# Altium project Assem_Stn_2_Rev1.PrjPcb (part 1 of 3)
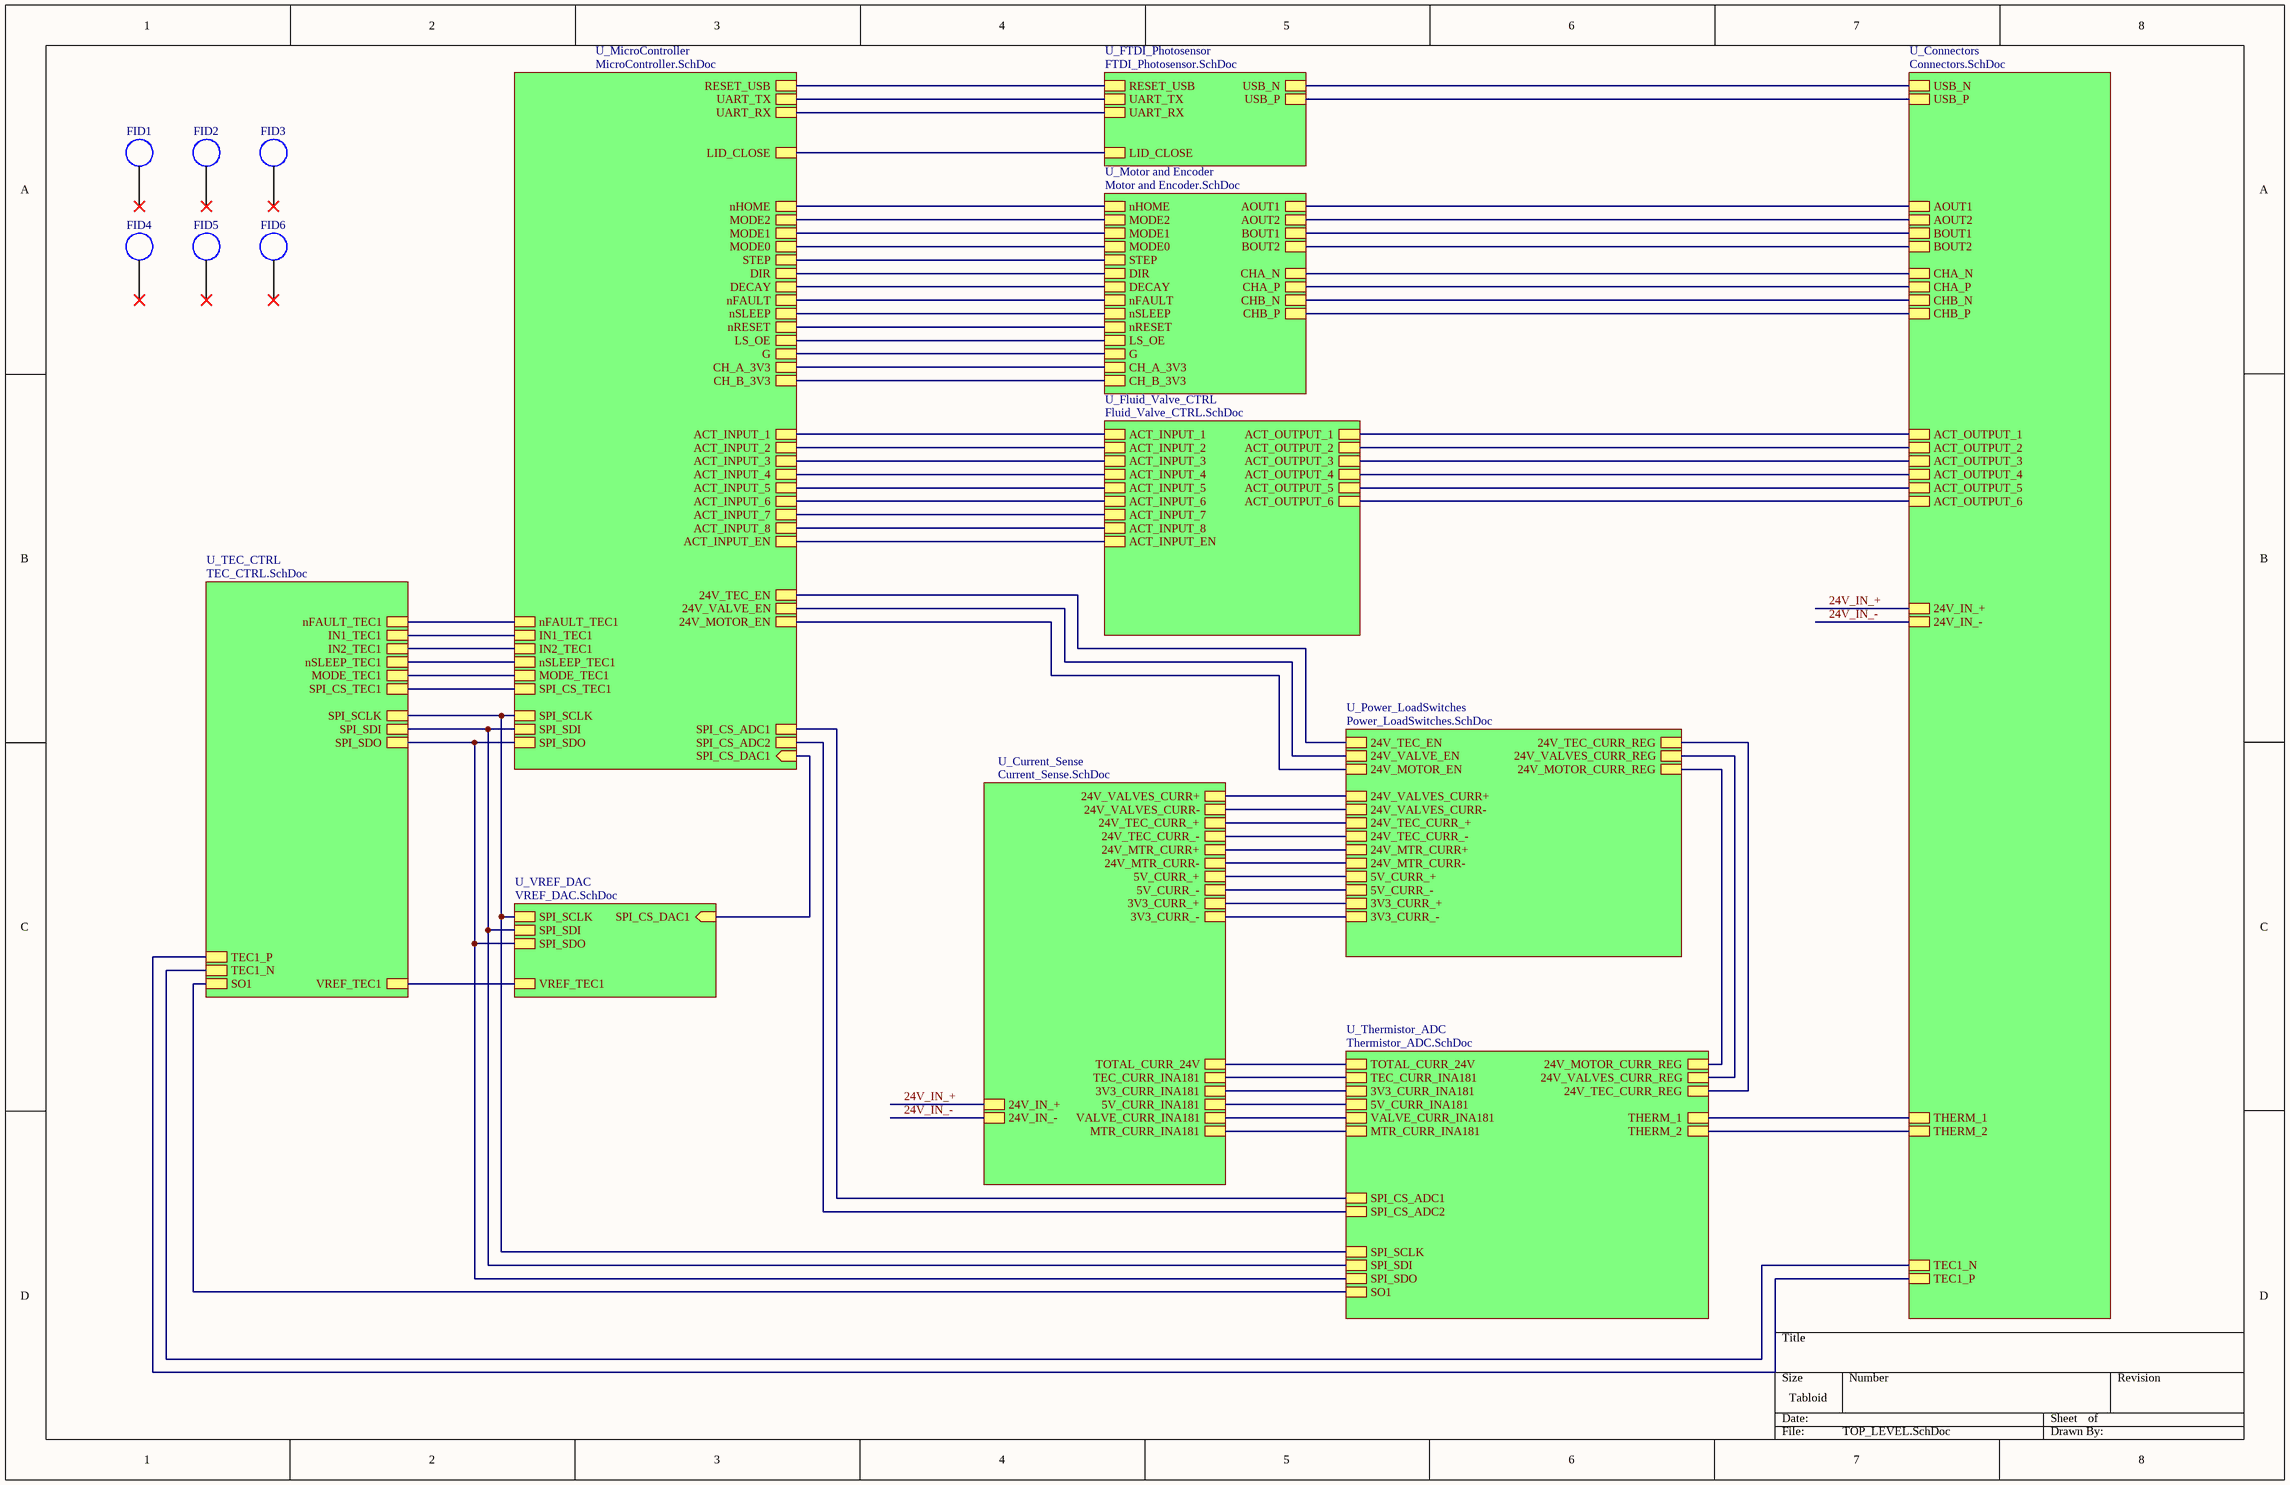
[diagram p0: TOP_LEVEL.SchDoc]
11 sheets, 438 parts. Net scope: hierarchical (ports join the sheet entries above them; power ports are global).
Board file: ASSEM_STN_2_Rev1.PcbDoc
Sheets:
  TOP_LEVEL.SchDoc
    U_Motor and Encoder = Motor and Encoder.SchDoc
    U_Power_LoadSwitches = Power_LoadSwitches.SchDoc
    U_TEC_CTRL = TEC_CTRL.SchDoc
    U_Fluid_Valve_CTRL = Fluid_Valve_CTRL.SchDoc
    U_Thermistor_ADC = Thermistor_ADC.SchDoc
    U_VREF_DAC = VREF_DAC.SchDoc
    U_Current_Sense = Current_Sense.SchDoc
    U_FTDI_Photosensor = FTDI_Photosensor.SchDoc
    U_MicroController = MicroController.SchDoc
    U_Connectors = Connectors.SchDoc

## Sheet TOP_LEVEL.SchDoc
size Tabloid; SheetNumber: 1; SheetTotal: 11

### Parts
FID1  FIDUCIAL  [Fiducial]  (value not drawn)
FID2  FIDUCIAL  [Fiducial]  (value not drawn)
FID3  FIDUCIAL  [Fiducial]  (value not drawn)
FID4  FIDUCIAL  [Fiducial]  (value not drawn)
FID5  FIDUCIAL  [Fiducial]  (value not drawn)
FID6  FIDUCIAL  [Fiducial]  (value not drawn)

### Sub-sheets
U_Connectors = Connectors.SchDoc: 24V_IN_+, 24V_IN_-, TEC1_P, TEC1_N, THERM_1, THERM_2, ACT_OUTPUT_1, ACT_OUTPUT_2, ACT_OUTPUT_3, ACT_OUTPUT_4, ACT_OUTPUT_5, ACT_OUTPUT_6, CHA_N, CHA_P, CHB_N, CHB_P, AOUT1, AOUT2, BOUT1, BOUT2, USB_N, USB_P
U_Current_Sense = Current_Sense.SchDoc: 24V_TEC_CURR_+, 24V_TEC_CURR_-, TEC_CURR_INA181, TOTAL_CURR_24V, 24V_IN_+, 24V_IN_-, 24V_VALVES_CURR+, 24V_VALVES_CURR-, VALVE_CURR_INA181, 5V_CURR_INA181, 3V3_CURR_INA181, 5V_CURR_+, 5V_CURR_-, 3V3_CURR_+, 3V3_CURR_-, 24V_MTR_CURR+, 24V_MTR_CURR-, MTR_CURR_INA181
U_Fluid_Valve_CTRL = Fluid_Valve_CTRL.SchDoc: ACT_INPUT_1, ACT_INPUT_2, ACT_INPUT_3, ACT_INPUT_4, ACT_OUTPUT_1, ACT_OUTPUT_2, ACT_OUTPUT_3, ACT_OUTPUT_4, ACT_INPUT_5, ACT_INPUT_6, ACT_INPUT_7, ACT_INPUT_8, ACT_OUTPUT_5, ACT_OUTPUT_6, ACT_INPUT_EN
U_FTDI_Photosensor = FTDI_Photosensor.SchDoc: RESET_USB, USB_N, USB_P, UART_TX, UART_RX, LID_CLOSE
U_MicroController = MicroController.SchDoc: UART_TX, UART_RX, nHOME, nFAULT, nSLEEP, nRESET, SPI_CS_DAC1 (in), SPI_CS_ADC1, SPI_CS_ADC2, CH_A_3V3, CH_B_3V3, IN1_TEC1, IN2_TEC1, nSLEEP_TEC1, MODE_TEC1, SPI_SCLK, SPI_SDI, SPI_CS_TEC1, nFAULT_TEC1, LS_OE, G, MODE2, MODE1, MODE0, STEP, DIR, DECAY, 24V_MOTOR_EN, 24V_VALVE_EN, 24V_TEC_EN, LID_CLOSE, SPI_SDO, ACT_INPUT_EN, RESET_USB, ACT_INPUT_1, ACT_INPUT_2, ACT_INPUT_3, ACT_INPUT_4, ACT_INPUT_5, ACT_INPUT_6, ACT_INPUT_7, ACT_INPUT_8
U_Motor and Encoder = Motor and Encoder.SchDoc: AOUT1, AOUT2, BOUT1, BOUT2, nHOME, MODE2, MODE1, MODE0, STEP, DIR, DECAY, nFAULT, nSLEEP, nRESET, CHA_N, CHA_P, CHB_N, CHB_P, G, CH_A_3V3, CH_B_3V3, LS_OE
U_Power_LoadSwitches = Power_LoadSwitches.SchDoc: 24V_TEC_EN, 24V_TEC_CURR_REG, 24V_VALVE_EN, 24V_VALVES_CURR_REG, 24V_VALVES_CURR+, 24V_VALVES_CURR-, 24V_TEC_CURR_+, 24V_TEC_CURR_-, 24V_MOTOR_EN, 24V_MOTOR_CURR_REG, 24V_MTR_CURR+, 24V_MTR_CURR-, 5V_CURR_+, 5V_CURR_-, 3V3_CURR_+, 3V3_CURR_-
U_TEC_CTRL = TEC_CTRL.SchDoc: IN1_TEC1, IN2_TEC1, nSLEEP_TEC1, MODE_TEC1, SPI_SCLK, SPI_SDI, SPI_CS_TEC1, SPI_SDO, nFAULT_TEC1, TEC1_P, TEC1_N, SO1, VREF_TEC1
U_Thermistor_ADC = Thermistor_ADC.SchDoc: THERM_1, THERM_2, SPI_CS_ADC1, 24V_TEC_CURR_REG, 24V_VALVES_CURR_REG, TEC_CURR_INA181, TOTAL_CURR_24V, VALVE_CURR_INA181, SPI_CS_ADC2, SPI_SDO, SPI_SDI, SPI_SCLK, 5V_CURR_INA181, 3V3_CURR_INA181, 24V_MOTOR_CURR_REG, SO1, MTR_CURR_INA181
U_VREF_DAC = VREF_DAC.SchDoc: VREF_TEC1, SPI_CS_DAC1 (in), SPI_SCLK, SPI_SDI, SPI_SDO

### Nets
3V3_CURR_+: sheet U_Power_LoadSwitches/3V3_CURR_+, sheet U_Current_Sense/3V3_CURR_+
3V3_CURR_-: sheet U_Power_LoadSwitches/3V3_CURR_-, sheet U_Current_Sense/3V3_CURR_-
3V3_CURR_INA181: sheet U_Thermistor_ADC/3V3_CURR_INA181, sheet U_Current_Sense/3V3_CURR_INA181
5V_CURR_+: sheet U_Power_LoadSwitches/5V_CURR_+, sheet U_Current_Sense/5V_CURR_+
5V_CURR_-: sheet U_Power_LoadSwitches/5V_CURR_-, sheet U_Current_Sense/5V_CURR_-
5V_CURR_INA181: sheet U_Thermistor_ADC/5V_CURR_INA181, sheet U_Current_Sense/5V_CURR_INA181
24V_IN_+: sheet U_Current_Sense/24V_IN_+, sheet U_Connectors/24V_IN_+
24V_IN_-: sheet U_Current_Sense/24V_IN_-, sheet U_Connectors/24V_IN_-
24V_MOTOR_CURR_REG: sheet U_Power_LoadSwitches/24V_MOTOR_CURR_REG, sheet U_Thermistor_ADC/24V_MOTOR_CURR_REG
24V_MOTOR_EN: sheet U_Power_LoadSwitches/24V_MOTOR_EN, sheet U_MicroController/24V_MOTOR_EN
24V_MTR_CURR+: sheet U_Power_LoadSwitches/24V_MTR_CURR+, sheet U_Current_Sense/24V_MTR_CURR+
24V_MTR_CURR-: sheet U_Power_LoadSwitches/24V_MTR_CURR-, sheet U_Current_Sense/24V_MTR_CURR-
24V_TEC_CURR_+: sheet U_Power_LoadSwitches/24V_TEC_CURR_+, sheet U_Current_Sense/24V_TEC_CURR_+
24V_TEC_CURR_-: sheet U_Power_LoadSwitches/24V_TEC_CURR_-, sheet U_Current_Sense/24V_TEC_CURR_-
24V_TEC_CURR_REG: sheet U_Power_LoadSwitches/24V_TEC_CURR_REG, sheet U_Thermistor_ADC/24V_TEC_CURR_REG
24V_TEC_EN: sheet U_Power_LoadSwitches/24V_TEC_EN, sheet U_MicroController/24V_TEC_EN
24V_VALVE_EN: sheet U_Power_LoadSwitches/24V_VALVE_EN, sheet U_MicroController/24V_VALVE_EN
24V_VALVES_CURR+: sheet U_Power_LoadSwitches/24V_VALVES_CURR+, sheet U_Current_Sense/24V_VALVES_CURR+
24V_VALVES_CURR-: sheet U_Power_LoadSwitches/24V_VALVES_CURR-, sheet U_Current_Sense/24V_VALVES_CURR-
24V_VALVES_CURR_REG: sheet U_Power_LoadSwitches/24V_VALVES_CURR_REG, sheet U_Thermistor_ADC/24V_VALVES_CURR_REG
ACT_INPUT_1: sheet U_Fluid_Valve_CTRL/ACT_INPUT_1, sheet U_MicroController/ACT_INPUT_1
ACT_INPUT_2: sheet U_Fluid_Valve_CTRL/ACT_INPUT_2, sheet U_MicroController/ACT_INPUT_2
ACT_INPUT_3: sheet U_Fluid_Valve_CTRL/ACT_INPUT_3, sheet U_MicroController/ACT_INPUT_3
ACT_INPUT_4: sheet U_Fluid_Valve_CTRL/ACT_INPUT_4, sheet U_MicroController/ACT_INPUT_4
ACT_INPUT_5: sheet U_Fluid_Valve_CTRL/ACT_INPUT_5, sheet U_MicroController/ACT_INPUT_5
ACT_INPUT_6: sheet U_Fluid_Valve_CTRL/ACT_INPUT_6, sheet U_MicroController/ACT_INPUT_6
ACT_INPUT_7: sheet U_Fluid_Valve_CTRL/ACT_INPUT_7, sheet U_MicroController/ACT_INPUT_7
ACT_INPUT_8: sheet U_Fluid_Valve_CTRL/ACT_INPUT_8, sheet U_MicroController/ACT_INPUT_8
ACT_INPUT_EN: sheet U_Fluid_Valve_CTRL/ACT_INPUT_EN, sheet U_MicroController/ACT_INPUT_EN
ACT_OUTPUT_1: sheet U_Fluid_Valve_CTRL/ACT_OUTPUT_1, sheet U_Connectors/ACT_OUTPUT_1
ACT_OUTPUT_2: sheet U_Fluid_Valve_CTRL/ACT_OUTPUT_2, sheet U_Connectors/ACT_OUTPUT_2
ACT_OUTPUT_3: sheet U_Fluid_Valve_CTRL/ACT_OUTPUT_3, sheet U_Connectors/ACT_OUTPUT_3
ACT_OUTPUT_4: sheet U_Fluid_Valve_CTRL/ACT_OUTPUT_4, sheet U_Connectors/ACT_OUTPUT_4
ACT_OUTPUT_5: sheet U_Fluid_Valve_CTRL/ACT_OUTPUT_5, sheet U_Connectors/ACT_OUTPUT_5
ACT_OUTPUT_6: sheet U_Fluid_Valve_CTRL/ACT_OUTPUT_6, sheet U_Connectors/ACT_OUTPUT_6
AOUT1: sheet U_Motor and Encoder/AOUT1, sheet U_Connectors/AOUT1
AOUT2: sheet U_Motor and Encoder/AOUT2, sheet U_Connectors/AOUT2
BOUT1: sheet U_Motor and Encoder/BOUT1, sheet U_Connectors/BOUT1
BOUT2: sheet U_Motor and Encoder/BOUT2, sheet U_Connectors/BOUT2
CH_A_3V3: sheet U_Motor and Encoder/CH_A_3V3, sheet U_MicroController/CH_A_3V3
CH_B_3V3: sheet U_Motor and Encoder/CH_B_3V3, sheet U_MicroController/CH_B_3V3
CHA_N: sheet U_Motor and Encoder/CHA_N, sheet U_Connectors/CHA_N
CHA_P: sheet U_Motor and Encoder/CHA_P, sheet U_Connectors/CHA_P
CHB_N: sheet U_Motor and Encoder/CHB_N, sheet U_Connectors/CHB_N
CHB_P: sheet U_Motor and Encoder/CHB_P, sheet U_Connectors/CHB_P
DECAY: sheet U_Motor and Encoder/DECAY, sheet U_MicroController/DECAY
DIR: sheet U_Motor and Encoder/DIR, sheet U_MicroController/DIR
G: sheet U_Motor and Encoder/G, sheet U_MicroController/G
IN1_TEC1: sheet U_TEC_CTRL/IN1_TEC1, sheet U_MicroController/IN1_TEC1
IN2_TEC1: sheet U_TEC_CTRL/IN2_TEC1, sheet U_MicroController/IN2_TEC1
LID_CLOSE: sheet U_FTDI_Photosensor/LID_CLOSE, sheet U_MicroController/LID_CLOSE
LS_OE: sheet U_Motor and Encoder/LS_OE, sheet U_MicroController/LS_OE
MODE0: sheet U_Motor and Encoder/MODE0, sheet U_MicroController/MODE0
MODE1: sheet U_Motor and Encoder/MODE1, sheet U_MicroController/MODE1
MODE2: sheet U_Motor and Encoder/MODE2, sheet U_MicroController/MODE2
MODE_TEC1: sheet U_TEC_CTRL/MODE_TEC1, sheet U_MicroController/MODE_TEC1
MTR_CURR_INA181: sheet U_Thermistor_ADC/MTR_CURR_INA181, sheet U_Current_Sense/MTR_CURR_INA181
nFAULT: sheet U_Motor and Encoder/nFAULT, sheet U_MicroController/nFAULT
nFAULT_TEC1: sheet U_TEC_CTRL/nFAULT_TEC1, sheet U_MicroController/nFAULT_TEC1
nHOME: sheet U_Motor and Encoder/nHOME, sheet U_MicroController/nHOME
nRESET: sheet U_Motor and Encoder/nRESET, sheet U_MicroController/nRESET
nSLEEP: sheet U_Motor and Encoder/nSLEEP, sheet U_MicroController/nSLEEP
nSLEEP_TEC1: sheet U_TEC_CTRL/nSLEEP_TEC1, sheet U_MicroController/nSLEEP_TEC1
RESET_USB: sheet U_FTDI_Photosensor/RESET_USB, sheet U_MicroController/RESET_USB
SO1: sheet U_TEC_CTRL/SO1, sheet U_Thermistor_ADC/SO1
SPI_CS_ADC1: sheet U_Thermistor_ADC/SPI_CS_ADC1, sheet U_MicroController/SPI_CS_ADC1
SPI_CS_ADC2: sheet U_Thermistor_ADC/SPI_CS_ADC2, sheet U_MicroController/SPI_CS_ADC2
SPI_CS_DAC1: sheet U_VREF_DAC/SPI_CS_DAC1, sheet U_MicroController/SPI_CS_DAC1
SPI_CS_TEC1: sheet U_TEC_CTRL/SPI_CS_TEC1, sheet U_MicroController/SPI_CS_TEC1
SPI_SCLK: sheet U_TEC_CTRL/SPI_SCLK, sheet U_Thermistor_ADC/SPI_SCLK, sheet U_VREF_DAC/SPI_SCLK, sheet U_MicroController/SPI_SCLK
SPI_SDI: sheet U_TEC_CTRL/SPI_SDI, sheet U_Thermistor_ADC/SPI_SDI, sheet U_VREF_DAC/SPI_SDI, sheet U_MicroController/SPI_SDI
SPI_SDO: sheet U_TEC_CTRL/SPI_SDO, sheet U_Thermistor_ADC/SPI_SDO, sheet U_VREF_DAC/SPI_SDO, sheet U_MicroController/SPI_SDO
STEP: sheet U_Motor and Encoder/STEP, sheet U_MicroController/STEP
TEC1_N: sheet U_TEC_CTRL/TEC1_N, sheet U_Connectors/TEC1_N
TEC1_P: sheet U_TEC_CTRL/TEC1_P, sheet U_Connectors/TEC1_P
TEC_CURR_INA181: sheet U_Thermistor_ADC/TEC_CURR_INA181, sheet U_Current_Sense/TEC_CURR_INA181
THERM_1: sheet U_Thermistor_ADC/THERM_1, sheet U_Connectors/THERM_1
THERM_2: sheet U_Thermistor_ADC/THERM_2, sheet U_Connectors/THERM_2
TOTAL_CURR_24V: sheet U_Thermistor_ADC/TOTAL_CURR_24V, sheet U_Current_Sense/TOTAL_CURR_24V
UART_RX: sheet U_FTDI_Photosensor/UART_RX, sheet U_MicroController/UART_RX
UART_TX: sheet U_FTDI_Photosensor/UART_TX, sheet U_MicroController/UART_TX
USB_N: sheet U_FTDI_Photosensor/USB_N, sheet U_Connectors/USB_N
USB_P: sheet U_FTDI_Photosensor/USB_P, sheet U_Connectors/USB_P
VALVE_CURR_INA181: sheet U_Thermistor_ADC/VALVE_CURR_INA181, sheet U_Current_Sense/VALVE_CURR_INA181
VREF_TEC1: sheet U_TEC_CTRL/VREF_TEC1, sheet U_VREF_DAC/VREF_TEC1

Not connected (* = marked no-connect by the designer): FID1 FID(0)*; FID2 FID(0)*; FID3 FID(0)*; FID4 FID(0)*; FID5 FID(0)*; FID6 FID(0)*

### Library data of the parts
FID1-FID6 = FIDUCIAL: 40mil Fudicial

## Sheet Motor and Encoder.SchDoc
size Tabloid; SheetNumber: 3; SheetTotal: 11
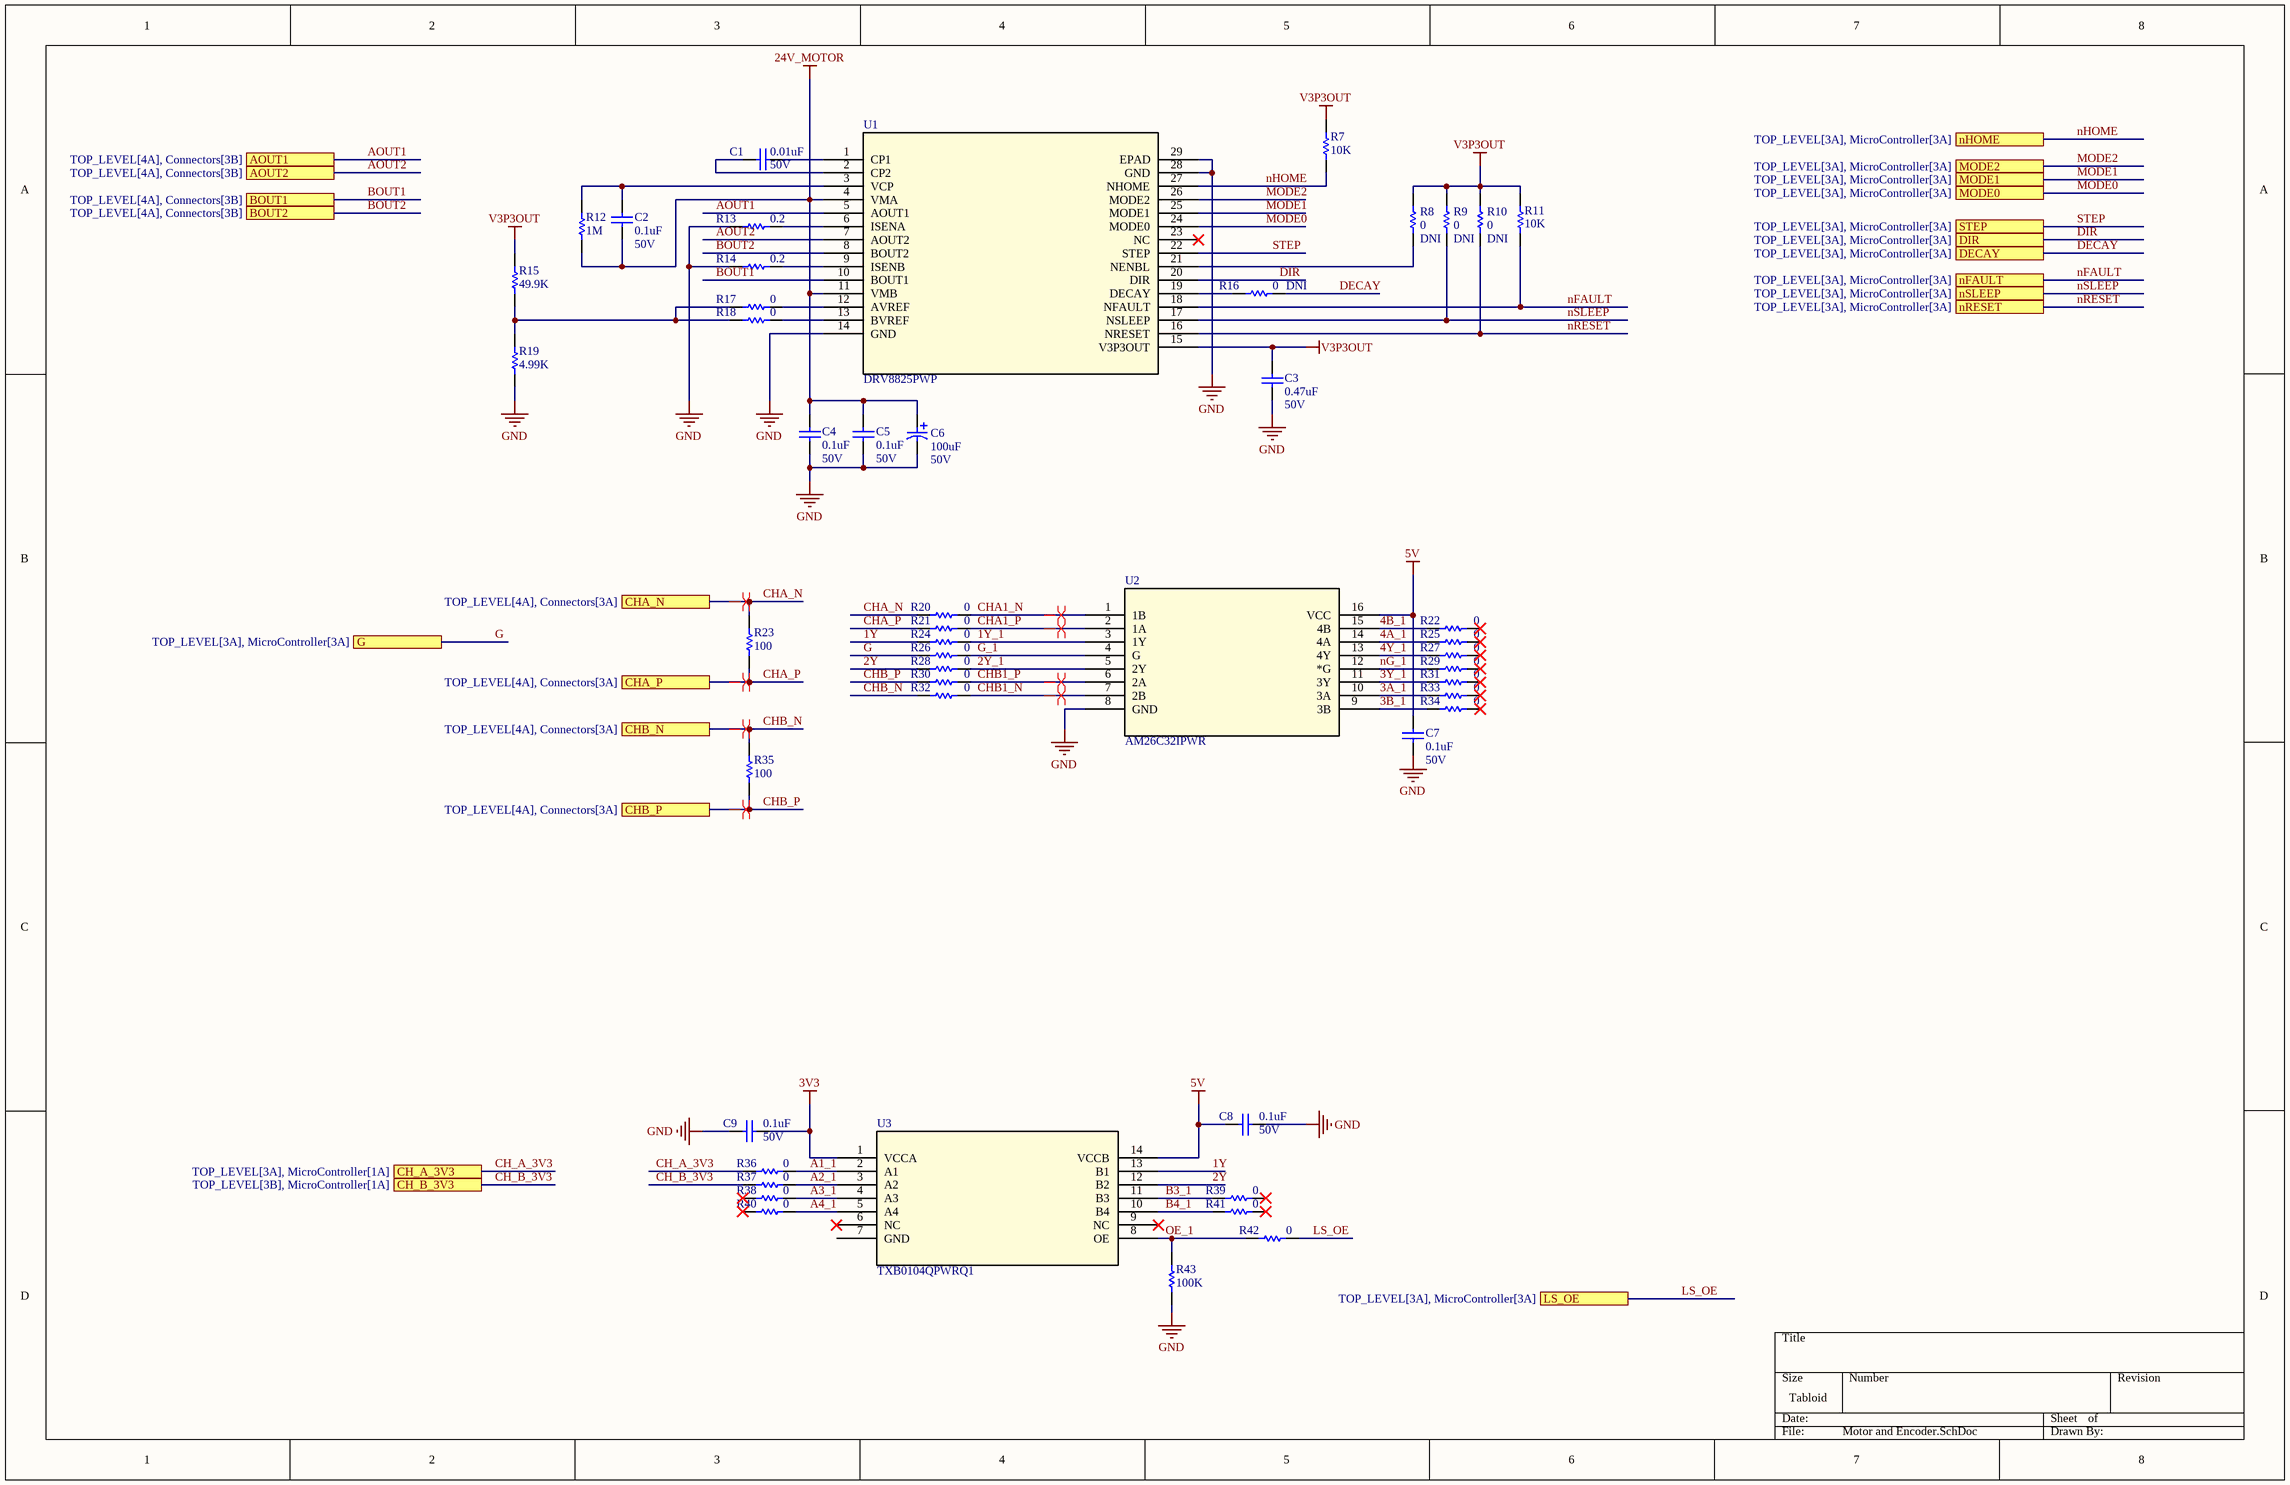
[diagram p1: Motor and Encoder.SchDoc]

### Parts
C1  value 0.01uF  Rating: 50V  [DEFAULT_CAPACITOR_0805]  (hidden comment: KGM21NR71H103KT)
C2  value 0.1uF  Rating: 50V  [DEFAULT_CAPACITOR_0805]  (hidden comment: KGM21NR71H104KT)
C3  value 0.47uF  Rating: 50V  [DEFAULT_CAPACITOR_0805]  (hidden comment: GRM21BR71H474KA88L)
C4  value 0.1uF  Rating: 50V  [DEFAULT_CAPACITOR_0805]  (hidden comment: KGM21NR71H104KT)
C5  value 0.1uF  Rating: 50V  [DEFAULT_CAPACITOR_0805]  (hidden comment: KGM21NR71H104KT)
C6  value 100uF  Rating: 50V  [UWT1H101MNL1GS]  (hidden comment: UWT1H101MNL1GS)
C7  value 0.1uF  Rating: 50V  [DEFAULT_CAPACITOR_0805]  (hidden comment: KGM21NR71H104KT)
C8  value 0.1uF  Rating: 50V  [DEFAULT_CAPACITOR_0805]  (hidden comment: KGM21NR71H104KT)
C9  value 0.1uF  Rating: 50V  [DEFAULT_CAPACITOR_0805]  (hidden comment: KGM21NR71H104KT)
R7  value 10K  [DEFAULT_RESISTOR_0805]  (hidden comment: CRCW080510K0FKEA)
R8  DNI  value 0  [DEFAULT_RESISTOR_0805]
R9  DNI  value 0  [DEFAULT_RESISTOR_0805]
R10  DNI  value 0  [DEFAULT_RESISTOR_0805]
R11  value 10K  [DEFAULT_RESISTOR_0805]  (hidden comment: CRCW080510K0FKEA)
R12  value 1M  [DEFAULT_RESISTOR_0805]  (hidden comment: CRCW08051M00FKEA)
R13  value 0.2  [DEFAULT_RESISTOR_0805]  (hidden comment: ERJ-6DSFR20V)
R14  value 0.2  [DEFAULT_RESISTOR_0805]  (hidden comment: ERJ-6DSFR20V)
R15  value 49.9K  [DEFAULT_RESISTOR_0805]  (hidden comment: RMCF0805FT49K9)
R16  DNI  value 0  [DEFAULT_RESISTOR_0805]
R17  value 0  [DEFAULT_RESISTOR_0805]  (hidden comment: RC0805JR-070RL)
R18  value 0  [DEFAULT_RESISTOR_0805]  (hidden comment: RC0805JR-070RL)
R19  value 4.99K  [DEFAULT_RESISTOR_0805]  (hidden comment: RMCF0805FT4K99)
R20  value 0  [DEFAULT_RESISTOR_0805]  (hidden comment: RC0805JR-070RL)
R21  value 0  [DEFAULT_RESISTOR_0805]  (hidden comment: RC0805JR-070RL)
R22  value 0  [DEFAULT_RESISTOR_0805]  (hidden comment: RC0805JR-070RL)
R23  value 100  [DEFAULT_RESISTOR_0805]  (hidden comment: CRCW0805100RFKEA)
R24  value 0  [DEFAULT_RESISTOR_0805]  (hidden comment: RC0805JR-070RL)
R25  value 0  [DEFAULT_RESISTOR_0805]  (hidden comment: RC0805JR-070RL)
R26  value 0  [DEFAULT_RESISTOR_0805]  (hidden comment: RC0805JR-070RL)
R27  value 0  [DEFAULT_RESISTOR_0805]  (hidden comment: RC0805JR-070RL)
R28  value 0  [DEFAULT_RESISTOR_0805]  (hidden comment: RC0805JR-070RL)
R29  value 0  [DEFAULT_RESISTOR_0805]  (hidden comment: RC0805JR-070RL)
R30  value 0  [DEFAULT_RESISTOR_0805]  (hidden comment: RC0805JR-070RL)
R31  value 0  [DEFAULT_RESISTOR_0805]  (hidden comment: RC0805JR-070RL)
R32  value 0  [DEFAULT_RESISTOR_0805]  (hidden comment: RC0805JR-070RL)
R33  value 0  [DEFAULT_RESISTOR_0805]  (hidden comment: RC0805JR-070RL)
R34  value 0  [DEFAULT_RESISTOR_0805]  (hidden comment: RC0805JR-070RL)
R35  value 100  [DEFAULT_RESISTOR_0805]  (hidden comment: CRCW0805100RFKEA)
R36  value 0  [DEFAULT_RESISTOR_0805]  (hidden comment: RC0805JR-070RL)
R37  value 0  [DEFAULT_RESISTOR_0805]  (hidden comment: RC0805JR-070RL)
R38  value 0  [DEFAULT_RESISTOR_0805]  (hidden comment: RC0805JR-070RL)
R39  value 0  [DEFAULT_RESISTOR_0805]  (hidden comment: RC0805JR-070RL)
R40  value 0  [DEFAULT_RESISTOR_0805]  (hidden comment: RC0805JR-070RL)
R41  value 0  [DEFAULT_RESISTOR_0805]  (hidden comment: RC0805JR-070RL)
R42  value 0  [DEFAULT_RESISTOR_0805]  (hidden comment: RC0805JR-070RL)
R43  value 100K  [DEFAULT_RESISTOR_0805]  (hidden comment: RC0805FR-07100KL)
U1  DRV8825PWP  [DRV8825PWP - 28HTSSTOP]
U2  AM26C32IPWR  [AM26C32IPWR]
U3  TXB0104QPWRQ1  [TXB0104QPWRQ1 - 14TSSOP]

### Ports
AOUT1 (see TOP_LEVEL[4A], Connectors[3B]), AOUT2 (see TOP_LEVEL[4A], Connectors[3B]), BOUT1 (see TOP_LEVEL[4A], Connectors[3B]), BOUT2 (see TOP_LEVEL[4A], Connectors[3B]), CH_A_3V3 (see TOP_LEVEL[3A], MicroController[1A]), CH_B_3V3 (see TOP_LEVEL[3B], MicroController[1A]), CHA_N (see TOP_LEVEL[4A], Connectors[3A]), CHA_P (see TOP_LEVEL[4A], Connectors[3A]), CHB_N (see TOP_LEVEL[4A], Connectors[3A]), CHB_P (see TOP_LEVEL[4A], Connectors[3A]), DECAY (see TOP_LEVEL[3A], MicroController[3A]), DIR (see TOP_LEVEL[3A], MicroController[3A]), G (see TOP_LEVEL[3A], MicroController[3A]), LS_OE (see TOP_LEVEL[3A], MicroController[3A]), MODE0 (see TOP_LEVEL[3A], MicroController[3A]), MODE1 (see TOP_LEVEL[3A], MicroController[3A]), MODE2 (see TOP_LEVEL[3A], MicroController[3A]), nFAULT (see TOP_LEVEL[3A], MicroController[3A]), nHOME (see TOP_LEVEL[3A], MicroController[3A]), nRESET (see TOP_LEVEL[3A], MicroController[3A]), nSLEEP (see TOP_LEVEL[3A], MicroController[3A]), STEP (see TOP_LEVEL[3A], MicroController[3A])

### Nets
3V3: C9.1 U3.1(VCCA)
5V: C7.2 C8.2 U2.16(VCC) U3.14(VCCB)
24V_MOTOR: C2.2 C4.1 C5.1 C6.1 R12.2 U1.4(VMA) U1.11(VMB)
GND: C3.1 C4.2 C5.2 C6.2 C7.1 C8.1 C9.2 R13.2 R14.2 R19.2 R43.2 U1.14(GND) U1.28(GND) U1.29(EPAD) U2.8(GND)
V3P3OUT: C3.2 R7.1 R8.1 R9.1 R10.1 R11.1 R15.1 U1.15(V3P3OUT)
1Y: R24.2 U3.13(B1)
1Y_1: R24.1 U2.3(1Y)
2Y: R28.2 U3.12(B2)
2Y_1: R28.1 U2.5(2Y)
3A_1: R33.2 U2.10(3A)
3B_1: R34.2 U2.9(3B)
3Y_1: R31.2 U2.11(3Y)
4A_1: R25.2 U2.14(4A)
4B_1: R22.2 U2.15(4B)
4Y_1: R27.2 U2.13(4Y)
A1_1: R36.1 U3.2(A1)
A2_1: R37.1 U3.3(A2)
A3_1: R38.1 U3.4(A3)
A4_1: R40.1 U3.5(A4)
AOUT1: U1.5(AOUT1) ; port AOUT1
AOUT2: U1.7(AOUT2) ; port AOUT2
B3_1: R39.2 U3.11(B3)
B4_1: R41.2 U3.10(B4)
BOUT1: U1.10(BOUT1) ; port BOUT1
BOUT2: U1.8(BOUT2) ; port BOUT2
CH_A_3V3: R36.2 ; port CH_A_3V3
CH_B_3V3: R37.2 ; port CH_B_3V3
CHA1_N: R20.1 U2.1(1B)
CHA1_P: R21.1 U2.2(1A)
CHA_N: R20.2 R23.1 ; port CHA_N
CHA_P: R21.2 R23.2 ; port CHA_P
CHB1_N: R32.1 U2.7(2B)
CHB1_P: R30.1 U2.6(2A)
CHB_N: R32.2 R35.1 ; port CHB_N
CHB_P: R30.2 R35.2 ; port CHB_P
DECAY: R16.1 ; port DECAY
DIR: U1.20(DIR) ; port DIR
G: R26.2 ; port G
G_1: R26.1 U2.4(G)
LS_OE: R42.1 ; port LS_OE
MODE0: U1.24(MODE0) ; port MODE0
MODE1: U1.25(MODE1) ; port MODE1
MODE2: U1.26(MODE2) ; port MODE2
nFAULT: R11.2 U1.18(NFAULT) ; port nFAULT
nG_1: R29.2 U2.12(*G)
nHOME: R7.2 U1.27(NHOME) ; port nHOME
nRESET: R10.2 U1.16(NRESET) ; port nRESET
nSLEEP: R9.2 U1.17(NSLEEP) ; port nSLEEP
OE_1: R42.2 R43.1 U3.8(OE)
STEP: U1.22(STEP) ; port STEP
NetC1_1: C1.1 U1.1(CP1)
NetC1_2: C1.2 U1.2(CP2)
NetC2_1: C2.1 R12.1 U1.3(VCP)
NetR8_2: R8.2 U1.21(NENBL)
NetR13_1: R13.1 U1.6(ISENA)
NetR14_1: R14.1 U1.9(ISENB)
NetR15_2: R15.2 R17.2 R18.2 R19.1
NetR16_2: R16.2 U1.19(DECAY)
NetR17_1: R17.1 U1.12(AVREF)
NetR18_1: R18.1 U1.13(BVREF)

Not connected (* = marked no-connect by the designer): R22 1*; R25 1*; R27 1*; R29 1*; R31 1*; R33 1*; R34 1*; R38 2*; R39 1*; R40 2*; R41 1*; U1 23(NC)*; U3 6(NC)* 7(GND) 9(NC)*

### Layout directives
differential pair: CHA1_N, CHA1_P, CHA_N, CHA_P, CHB1_N, CHB1_P, CHB_N, CHB_P

### Library data of the parts
C1 = KGM21NR71H103KT: CAP CER 10000PF 50V X7R 0805; Manufacturer: Cal-Chip Electronics, Inc.; Manufacturer P/N: GMC55X7R226M50NT; MFR PN: KGM21NR71H103KT
C2 C4 C5 C7-C9 = KGM21NR71H104KT: CAP CER 0.1UF 50V X7R 0805; Manufacturer: Cal-Chip Electronics, Inc.; Manufacturer P/N: GMC55X7R226M50NT; MFR PN: KGM21NR71H104KT
C3 = GRM21BR71H474KA88L: CAP CER 0.47UF 50V X7R 0805; Manufacturer: Cal-Chip Electronics, Inc.; Manufacturer P/N: GMC55X7R226M50NT; MFR PN: GRM21BR71H474KA88L
C6 = UWT1H101MNL1GS: CAP ALUM 100UF 20% 50V SMD; Manufacturer_Name: Nichicon; Copyright: Copyright (C) 2026 Ultra Librarian. All rights reserved.; Manufacturer_Part_Number: UWT1H101MNL1GS; MFR PN: UWT1H101MNL1GS
R7 R11 = CRCW080510K0FKEA: RES SMD 10K OHM 1% 1/4W 0805; Power: 1/4W; MFR PN: CRCW080510K0FKEA; Tolerance: 1%
R8-R10 R16-R18 R20-R22 R24-R34 R36-R42 = RC0805JR-070RL: RES 0 OHM JUMPER 1/8W 0805; Power: 1/8W; MFR PN: RC0805JR-070RL; Tolerance: *
R12 = CRCW08051M00FKEA: RES SMD 1M OHM 1% 1/4W 0805; Power: 1/4W; MFR PN: CRCW08051M00FKEA; Tolerance: 1%
R13 R14 = ERJ-6DSFR20V: RES 0.2 OHM 1% 1/2W 0805; MFR PN: ERJ-6DSFR20V; Tolerance: 1%
R15 = RMCF0805FT49K9: RES 49.9K OHM 1% 1/8W 0805; Power: 1/8W; MFR PN: RMCF0805FT49K9; Tolerance: 1%
R19 = RMCF0805FT4K99: RES 4.99K OHM 1% 1/8W 0805; Power: 1/8W; MFR PN: RMCF0805FT4K99; Tolerance: 1%
R23 R35 = CRCW0805100RFKEA: RES SMD 100 OHM 1% 1/4W 0805; Power: 1/4W; MFR PN: CRCW0805100RFKEA; Tolerance: 1%
R43 = RC0805FR-07100KL: RES 100K OHM 1% 1/8W 0805; Power: 1/8W; MFR PN: RC0805FR-07100KL; Tolerance: 1%
U1 = DRV8825PWP: 45-V, 2.5-A bipolar stepper motor driver with current regulation and 1/32 microstepping Â  28-HTSSOP -40 to 85; Manufacturer_Name: Texas Instruments; Copyright: Copyright (C) 2026 Ultra Librarian. All rights reserved.; Manufacturer_Part_Number: DRV8825PWP; RefDes: RefDes; Type: Type; MFR PN: DRV8825PWP
U2 = AM26C32IPWR: Quadruple Differential Line Receiver 16-TSSOP -40 to 85; Manufacturer_Name: Texas Instruments; Copyright: Copyright (C) 2025 Ultra Librarian. All rights reserved.; Manufacturer_Part_Number: AM26C32IPWR; RefDes: RefDes; Type: Type; MFR PN: AM26C32IPWR
U3 = TXB0104QPWRQ1: Automotive 4-bit bidirectional voltage-level translator with auto direction sensing and +/-15kV ESD 14-TSSOP -40 to 125; Manufacturer_Name: Texas Instruments; Copyright: Copyright (C) 2025 Ultra Librarian. All rights reserved.; Manufacturer_Part_Number: TXB0104QPWRQ1; RefDes: RefDes; Type: Type; MFR PN: TXB0104QPWRQ1

## Sheet Power_LoadSwitches.SchDoc
size OrCAD B; SheetNumber: 4; SheetTotal: 11
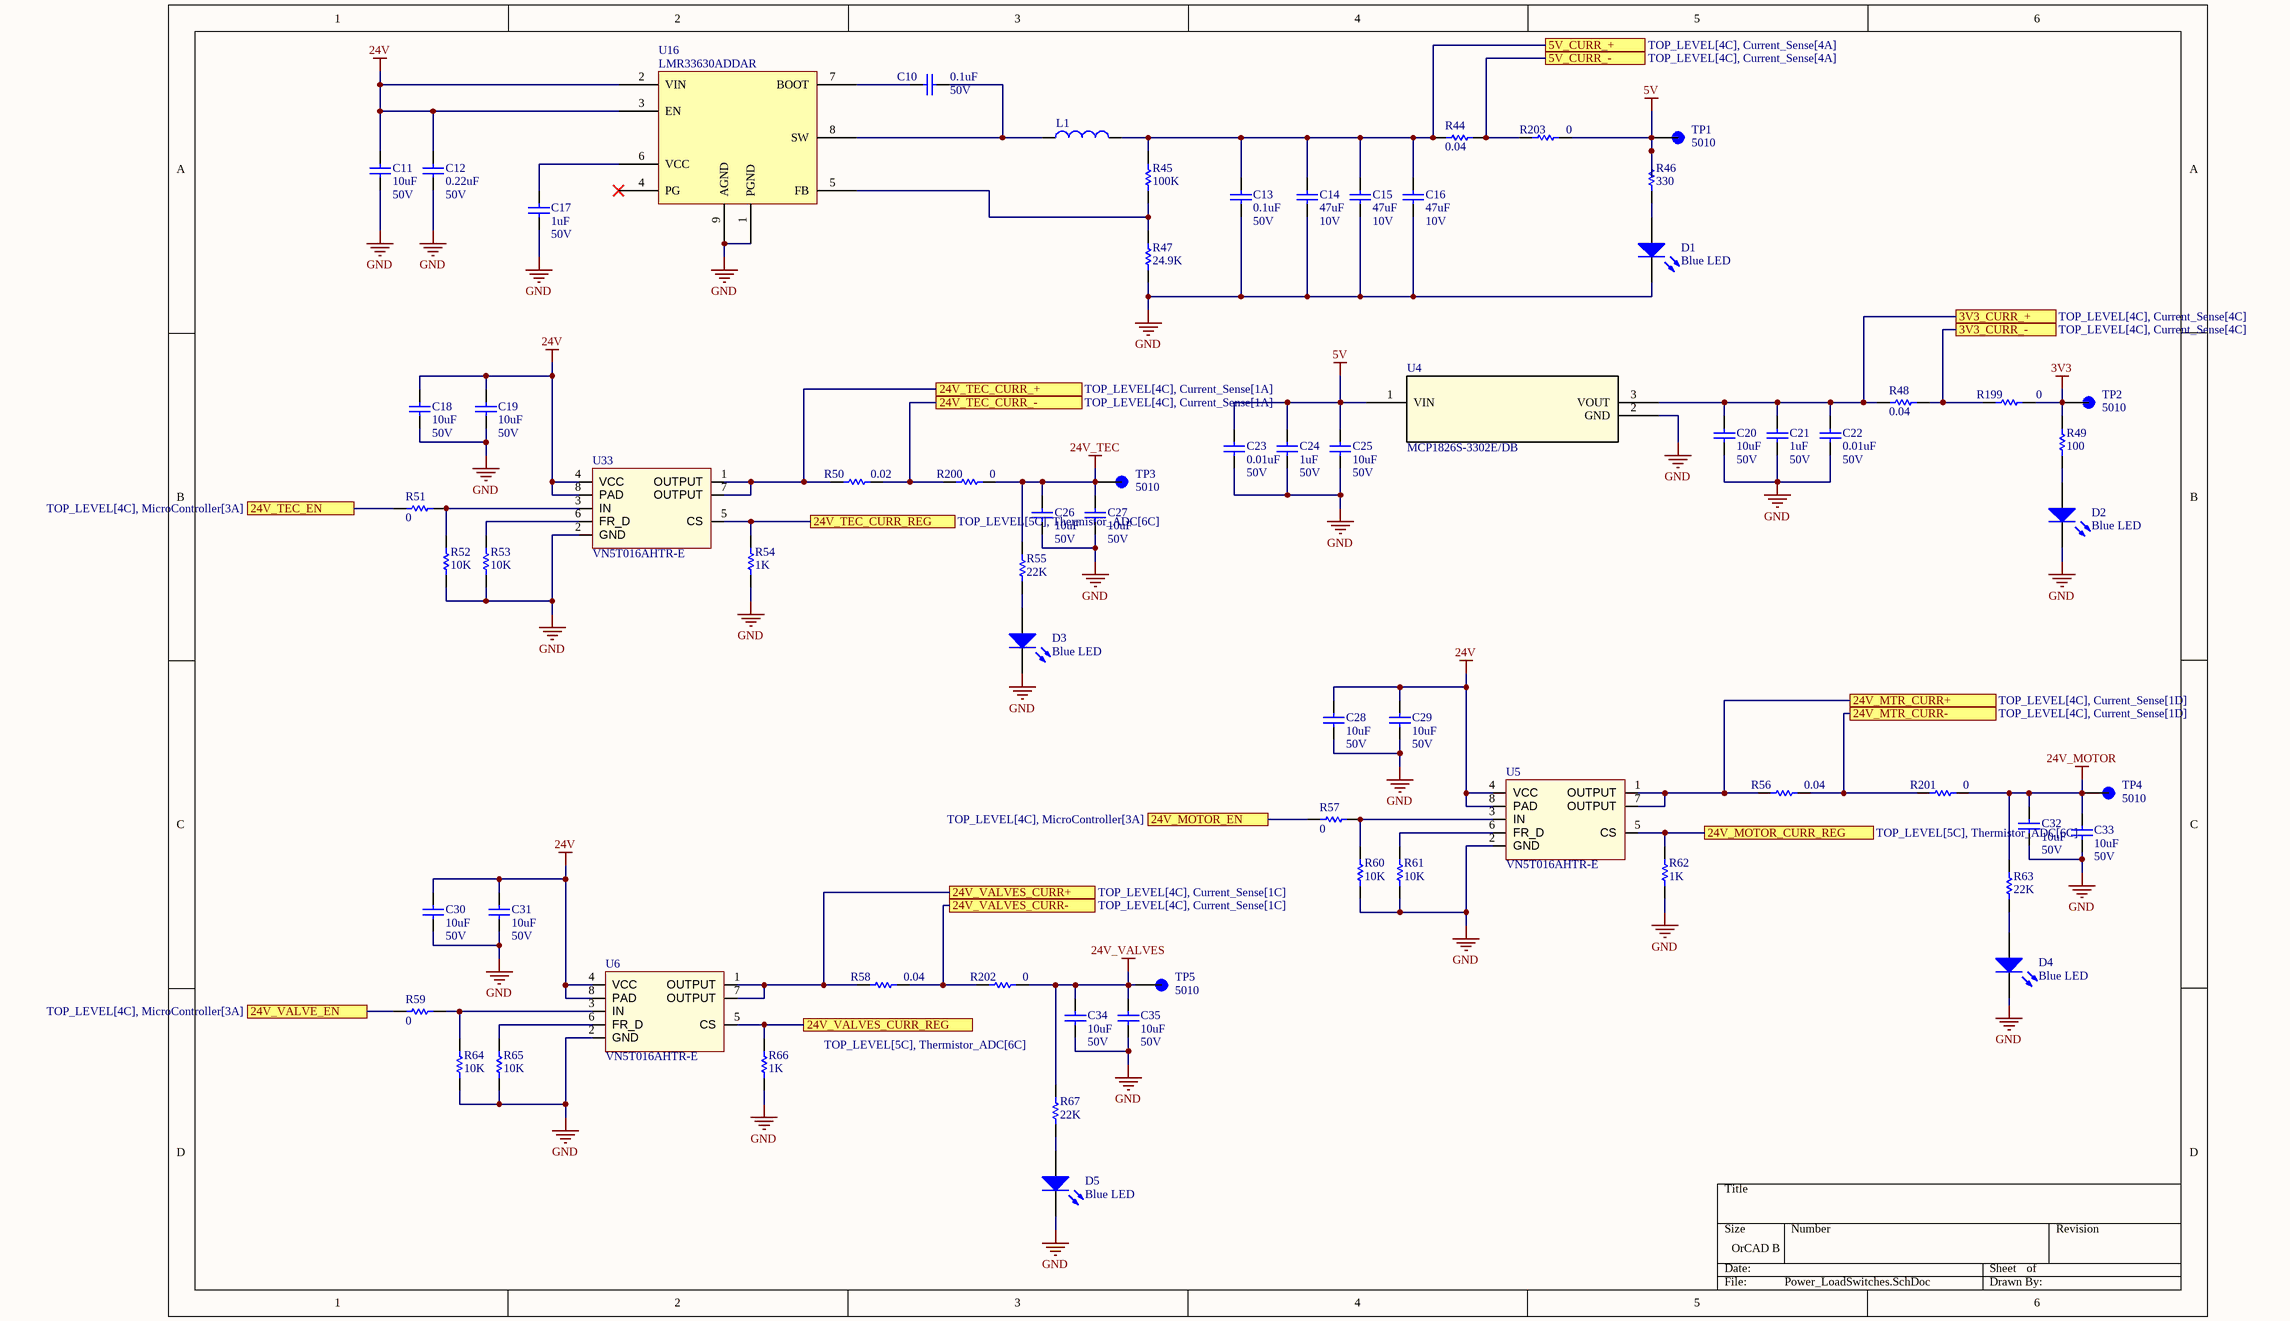
[diagram p2: Power_LoadSwitches.SchDoc]

### Parts
C10  value 0.1uF  Rating: 50V  [DEFAULT_CAPACITOR_0805]  (hidden comment: KGM21NR71H104KT)
C11  value 10uF  Rating: 50V  [DEFAULT_CAPACITOR_0805]  (hidden comment: GRM21BR61H106KE43L)
C12  value 0.22uF  Rating: 50V  [DEFAULT_CAPACITOR_0805]  (hidden comment: C0805C224K5RACTU)
C13  value 0.1uF  Rating: 50V  [DEFAULT_CAPACITOR_0805]  (hidden comment: KGM21NR71H104KT)
C14  value 47uF  Rating: 10V  [DEFAULT_CAPACITOR_0805]  (hidden comment: GRM21BR61A476ME15L)
C15  value 47uF  Rating: 10V  [DEFAULT_CAPACITOR_0805]  (hidden comment: GRM21BR61A476ME15L)
C16  value 47uF  Rating: 10V  [DEFAULT_CAPACITOR_0805]  (hidden comment: GRM21BR61A476ME15L)
C17  value 1uF  Rating: 50V  [DEFAULT_CAPACITOR_0805]  (hidden comment: CL21B105KBFNNNE)
C18  value 10uF  Rating: 50V  [DEFAULT_CAPACITOR_0805]  (hidden comment: GRM21BR61H106KE43L)
C19  value 10uF  Rating: 50V  [DEFAULT_CAPACITOR_0805]  (hidden comment: GRM21BR61H106KE43L)
C20  value 10uF  Rating: 50V  [DEFAULT_CAPACITOR_0805]  (hidden comment: GRM21BR61H106KE43L)
C21  value 1uF  Rating: 50V  [DEFAULT_CAPACITOR_0805]  (hidden comment: CL21B105KBFNNNE)
C22  value 0.01uF  Rating: 50V  [DEFAULT_CAPACITOR_0805]  (hidden comment: KGM21NR71H103KT)
C23  value 0.01uF  Rating: 50V  [DEFAULT_CAPACITOR_0805]  (hidden comment: KGM21NR71H103KT)
C24  value 1uF  Rating: 50V  [DEFAULT_CAPACITOR_0805]  (hidden comment: CL21B105KBFNNNE)
C25  value 10uF  Rating: 50V  [DEFAULT_CAPACITOR_0805]  (hidden comment: GRM21BR61H106KE43L)
C26  value 10uF  Rating: 50V  [DEFAULT_CAPACITOR_0805]  (hidden comment: GRM21BR61H106KE43L)
C27  value 10uF  Rating: 50V  [DEFAULT_CAPACITOR_0805]  (hidden comment: GRM21BR61H106KE43L)
C28  value 10uF  Rating: 50V  [DEFAULT_CAPACITOR_0805]  (hidden comment: GRM21BR61H106KE43L)
C29  value 10uF  Rating: 50V  [DEFAULT_CAPACITOR_0805]  (hidden comment: GRM21BR61H106KE43L)
C30  value 10uF  Rating: 50V  [DEFAULT_CAPACITOR_0805]  (hidden comment: GRM21BR61H106KE43L)
C31  value 10uF  Rating: 50V  [DEFAULT_CAPACITOR_0805]  (hidden comment: GRM21BR61H106KE43L)
C32  value 10uF  Rating: 50V  [DEFAULT_CAPACITOR_0805]  (hidden comment: GRM21BR61H106KE43L)
C33  value 10uF  Rating: 50V  [DEFAULT_CAPACITOR_0805]  (hidden comment: GRM21BR61H106KE43L)
C34  value 10uF  Rating: 50V  [DEFAULT_CAPACITOR_0805]  (hidden comment: GRM21BR61H106KE43L)
C35  value 10uF  Rating: 50V  [DEFAULT_CAPACITOR_0805]  (hidden comment: GRM21BR61H106KE43L)
D1  value Blue LED  [DEFAULT_RESISTOR_0805]  (hidden comment: LSM0805463V)
D2  value Blue LED  [DEFAULT_RESISTOR_0805]  (hidden comment: LSM0805463V)
D3  value Blue LED  [DEFAULT_RESISTOR_0805]  (hidden comment: LSM0805463V)
D4  value Blue LED  [DEFAULT_RESISTOR_0805]  (hidden comment: LSM0805463V)
D5  value Blue LED  [DEFAULT_RESISTOR_0805]  (hidden comment: LSM0805463V)
L1  744771008  [744771008]  (value not drawn)
R44  value 0.04  [DEFAULT_RESISTOR_0805]  (hidden comment: WSLP0805R0400DEA)
R45  value 100K  [DEFAULT_RESISTOR_0805]  (hidden comment: RC0805FR-07100KL)
R46  value 330  [DEFAULT_RESISTOR_0805]  (hidden comment: RMCF0805FT330R)
R47  value 24.9K  [DEFAULT_RESISTOR_0805]  (hidden comment: RMCF0805FT24K9)
R48  value 0.04  [DEFAULT_RESISTOR_0805]  (hidden comment: WSLP0805R0400DEA)
R49  value 100  [DEFAULT_RESISTOR_0805]  (hidden comment: CRCW0805100RFKEA)
R50  value 0.02  [DEFAULT_RESISTOR_0805]  (hidden comment: ERJ-6CWDR020V)
R51  value 0  [DEFAULT_RESISTOR_0805]  (hidden comment: RC0805JR-070RL)
R52  value 10K  [DEFAULT_RESISTOR_0805]  (hidden comment: CRCW080510K0FKEA)
R53  value 10K  [DEFAULT_RESISTOR_0805]  (hidden comment: CRCW080510K0FKEA)
R54  value 1K  [DEFAULT_RESISTOR_0805]  (hidden comment: CRCW08051K00FKEA)
R55  value 22K  [DEFAULT_RESISTOR_0805]  (hidden comment: RC0805FR-1322KL)
R56  value 0.04  [DEFAULT_RESISTOR_0805]  (hidden comment: WSLP0805R0400DEA)
R57  value 0  [DEFAULT_RESISTOR_0805]  (hidden comment: RC0805JR-070RL)
R58  value 0.04  [DEFAULT_RESISTOR_0805]  (hidden comment: WSLP0805R0400DEA)
R59  value 0  [DEFAULT_RESISTOR_0805]  (hidden comment: RC0805JR-070RL)
R60  value 10K  [DEFAULT_RESISTOR_0805]  (hidden comment: CRCW080510K0FKEA)
R61  value 10K  [DEFAULT_RESISTOR_0805]  (hidden comment: CRCW080510K0FKEA)
R62  value 1K  [DEFAULT_RESISTOR_0805]  (hidden comment: CRCW08051K00FKEA)
R63  value 22K  [DEFAULT_RESISTOR_0805]  (hidden comment: RC0805FR-1322KL)
R64  value 10K  [DEFAULT_RESISTOR_0805]  (hidden comment: CRCW080510K0FKEA)
R65  value 10K  [DEFAULT_RESISTOR_0805]  (hidden comment: CRCW080510K0FKEA)
R66  value 1K  [DEFAULT_RESISTOR_0805]  (hidden comment: CRCW08051K00FKEA)
R67  value 22K  [DEFAULT_RESISTOR_0805]  (hidden comment: RC0805FR-1322KL)
R199  value 0  [DEFAULT_RESISTOR_0805]  (hidden comment: RC0805JR-070RL)
R200  value 0  [DEFAULT_RESISTOR_0805]  (hidden comment: RC0805JR-070RL)
R201  value 0  [DEFAULT_RESISTOR_0805]  (hidden comment: RC0805JR-070RL)
R202  value 0  [DEFAULT_RESISTOR_0805]  (hidden comment: RC0805JR-070RL)
R203  value 0  [DEFAULT_RESISTOR_0805]  (hidden comment: RC0805JR-070RL)
TP1  5010  [TP_5011]
TP2  5010  [TP_5011]
TP3  5010  [TP_5011]
TP4  5010  [TP_5011]
TP5  5010  [TP_5011]
U4  MCP1826S-3302E/DB  [MCP1826S-3302E/DB]
U5  VN5T016AHTR-E  [VN5T016AHTR-E-HPAK]
U6  VN5T016AHTR-E  [VN5T016AHTR-E-HPAK]
U16  LMR33630ADDAR  [VREG_LM5017MR/NOPB]
U33  VN5T016AHTR-E  [VN5T016AHTR-E-HPAK]

### Ports
3V3_CURR_+ (see TOP_LEVEL[4C], Current_Sense[4C]), 3V3_CURR_- (see TOP_LEVEL[4C], Current_Sense[4C]), 5V_CURR_+ (see TOP_LEVEL[4C], Current_Sense[4A]), 5V_CURR_- (see TOP_LEVEL[4C], Current_Sense[4A]), 24V_MOTOR_CURR_REG (see TOP_LEVEL[5C], Thermistor_ADC[6C]), 24V_MOTOR_EN (see TOP_LEVEL[4C], MicroController[3A]), 24V_MTR_CURR+ (see TOP_LEVEL[4C], Current_Sense[1D]), 24V_MTR_CURR- (see TOP_LEVEL[4C], Current_Sense[1D]), 24V_TEC_CURR_+ (see TOP_LEVEL[4C], Current_Sense[1A]), 24V_TEC_CURR_- (see TOP_LEVEL[4C], Current_Sense[1A]), 24V_TEC_CURR_REG (see TOP_LEVEL[5C], Thermistor_ADC[6C]), 24V_TEC_EN (see TOP_LEVEL[4C], MicroController[3A]), 24V_VALVE_EN (see TOP_LEVEL[4C], MicroController[3A]), 24V_VALVES_CURR+ (see TOP_LEVEL[4C], Current_Sense[1C]), 24V_VALVES_CURR- (see TOP_LEVEL[4C], Current_Sense[1C]), 24V_VALVES_CURR_REG (see TOP_LEVEL[5C], Thermistor_ADC[6C])

### Nets
3V3: R49.1 R199.1 TP2.TP
5V: C23.2 C24.2 C25.2 R46.1 R203.1 TP1.TP U4.1(VIN)
24V: C11.2 C12.2 C18.2 C19.2 C28.2 C29.2 C30.2 C31.2 U5.4(VCC) U5.8(PAD) U6.4(VCC) U6.8(PAD) U16.2(VIN) U16.3(EN) U33.4(VCC) U33.8(PAD)
24V_MOTOR: C32.2 C33.2 R63.1 R201.1 TP4.TP
24V_TEC: C26.2 C27.2 R55.1 R200.1 TP3.TP
24V_VALVES: C34.2 C35.2 R67.1 R202.1 TP5.TP
GND: C11.1 C12.1 C13.1 C14.1 C15.1 C16.1 C17.1 C18.1 C19.1 C20.1 C21.1 C22.1 C23.1 C24.1 C25.1 C26.1 C27.1 C28.1 C29.1 C30.1 C31.1 C32.1 C33.1 C34.1 C35.1 D1.2(K) D2.2(K) D3.2(K) D4.2(K) D5.2(K) R47.2 R52.2 R53.2 R54.2 R60.2 R61.2 R62.2 R64.2 R65.2 R66.2 U4.2(GND) U5.2(GND) U6.2(GND) U16.1(PGND) U16.9(AGND) U33.2(GND)
3V3_CURR_+: C20.2 C21.2 C22.2 R48.2 U4.3(VOUT) ; port 3V3_CURR_+
3V3_CURR_-: R48.1 R199.2 ; port 3V3_CURR_-
5V_CURR_+: C13.2 C14.2 C15.2 C16.2 L1.2 R44.2 R45.1 ; port 5V_CURR_+
5V_CURR_-: R44.1 R203.2 ; port 5V_CURR_-
24V_MOTOR_CURR_REG: R62.1 U5.5(CS) ; port 24V_MOTOR_CURR_REG
24V_MOTOR_EN: R57.2 ; port 24V_MOTOR_EN
24V_MTR_CURR+: R56.2 U5.1(OUTPUT) U5.7(OUTPUT) ; port 24V_MTR_CURR+
24V_MTR_CURR-: R56.1 R201.2 ; port 24V_MTR_CURR-
24V_TEC_CURR_+: R50.2 U33.1(OUTPUT) U33.7(OUTPUT) ; port 24V_TEC_CURR_+
24V_TEC_CURR_-: R50.1 R200.2 ; port 24V_TEC_CURR_-
24V_TEC_CURR_REG: R54.1 U33.5(CS) ; port 24V_TEC_CURR_REG
24V_TEC_EN: R51.2 ; port 24V_TEC_EN
24V_VALVE_EN: R59.2 ; port 24V_VALVE_EN
24V_VALVES_CURR+: R58.2 U6.1(OUTPUT) U6.7(OUTPUT) ; port 24V_VALVES_CURR+
24V_VALVES_CURR-: R58.1 R202.2 ; port 24V_VALVES_CURR-
24V_VALVES_CURR_REG: R66.1 U6.5(CS) ; port 24V_VALVES_CURR_REG
NetC10_1: C10.1 L1.1 U16.8(SW)
NetC10_2: C10.2 U16.7(BOOT)
NetC17_2: C17.2 U16.6(VCC)
NetD1_1: D1.1(A) R46.2
NetD2_1: D2.1(A) R49.2
NetD3_1: D3.1(A) R55.2
NetD4_1: D4.1(A) R63.2
NetD5_1: D5.1(A) R67.2
NetR45_2: R45.2 R47.1 U16.5(FB)
NetR51_1: R51.1 R52.1 U33.3(IN)
NetR53_1: R53.1 U33.6(FR_D)
NetR57_1: R57.1 R60.1 U5.3(IN)
NetR59_1: R59.1 R64.1 U6.3(IN)
NetR61_1: R61.1 U5.6(FR_D)
NetR65_1: R65.1 U6.6(FR_D)

Not connected (* = marked no-connect by the designer): U16 4(PG)*

### Library data of the parts
C10 C13 = KGM21NR71H104KT: as C2 on sheet Motor and Encoder; MFR PN: KGM21NR71H104KT
C11 C18-C20 C25-C35 = GRM21BR61H106KE43L: CAP CER 10UF 50V X5R 0805; MFR PN: GRM21BR61H106KE43L
C12 = C0805C224K5RACTU: CAP CER 0.22UF 50V X7R 0805; MFR PN: C0805C224K5RACTU
C14-C16 = GRM21BR61A476ME15L: CAP CER 47UF 10V X5R 0805; MFR PN: GRM21BR61A476ME15L
C17 C21 C24 = CL21B105KBFNNNE: CAP CER 1UF 50V X7R 0805; MFR PN: CL21B105KBFNNNE
C22 C23 = KGM21NR71H103KT: as C1 on sheet Motor and Encoder; MFR PN: KGM21NR71H103KT
D1-D5 = LSM0805463V: LED BLUE; MP: Blue LED 0805; MFR PN: LSM0805463V
L1 = 744771008: FIXED IND 8.2UH 6.25A 20 MOHM; Value: 8.2uH; MFR PN: 744771008
R44 R48 R56 R58 = WSLP0805R0400DEA: RES 0.04 OHM 0.5% 1/2W 0805; Power: 1/2W; MFR PN: WSLP0805R0400DEA; Tolerance: 0.5%
R45 = RC0805FR-07100KL: RES 100K OHM 1% 1/8W 0805; Power: 1/8W; MFR PN: RC0805FR-07100KL; Tolerance: 1%
R46 = RMCF0805FT330R: RES 330 OHM 1% 1/8W 0805; MFR PN: RMCF0805FT330R; Tolerance: 1%
R47 = RMCF0805FT24K9: RES 24.9K OHM 1% 1/8W 0805; Power: 1/8W; MFR PN: RMCF0805FT24K9; Tolerance: 1%
R49 = CRCW0805100RFKEA: RES SMD 100 OHM 1% 1/4W 0805; Power: 1/4W; MFR PN: CRCW0805100RFKEA; Tolerance: 1%
R50 = ERJ-6CWDR020V: RES 0.02 OHM 0.5% 1/2W 0805; Power: 1/2W; MFR PN: ERJ-6CWDR020V; Tolerance: 0.5%; Parameter 1: *
R51 R57 R59 R199-R203 = RC0805JR-070RL: RES 0 OHM JUMPER 1/8W 0805; Power: 1/8W; MFR PN: RC0805JR-070RL; Tolerance: *
R52 R53 R60 R61 R64 R65 = CRCW080510K0FKEA: RES SMD 10K OHM 1% 1/4W 0805; Power: 1/4W; MFR PN: CRCW080510K0FKEA; Tolerance: 1%
R54 R62 R66 = CRCW08051K00FKEA: RES SMD 1K OHM 1% 1/4W 0805; Power: 1/4W; MFR PN: CRCW08051K00FKEA; Tolerance: 1%
R55 R63 R67 = RC0805FR-1322KL: RES 22K OHM 1% 1/8W 0805; Power: 1/8W; MFR PN: RC0805FR-1322KL; Tolerance: 1%
TP1-TP5 = 5010: PC TEST POINT MULTIPURPOSE RED; MFR PN: 5010
U4 = MCP1826S-3302E/DB: IC REG LINEAR 3.3V 1A SOT-223-3; Manufacturer_Name: Microchip; Copyright: Copyright (C) 2025 Ultra Librarian. All rights reserved.; Manufacturer_Part_Number: MCP1826S-3302E/DB; RefDes: RefDes; Type: Type; MFR PN: MCP1826S-3302E/DB
U5 U6 U33 = VN5T016AHTR-E: Power Switch/Driver 1:1 N-Channel 43A HPAK; Manufacturer: STMicroelectronics; Manufacturer P/N: VN5T016AHTR-E; MFR PN: VN5T016AHTR-E
U16 = LMR33630ADDAR: LMR33630 SIMPLE SWITCHER® 3.8-V to 36-V, 3-A / Synchronous Step-down Voltage Converter; Designer: OMIGA; MP: LMR33630ADDA; MFR PN: LMR33630ADDAR

## Sheet TEC_CTRL.SchDoc
size OrCAD B; SheetNumber: 5; SheetTotal: 11
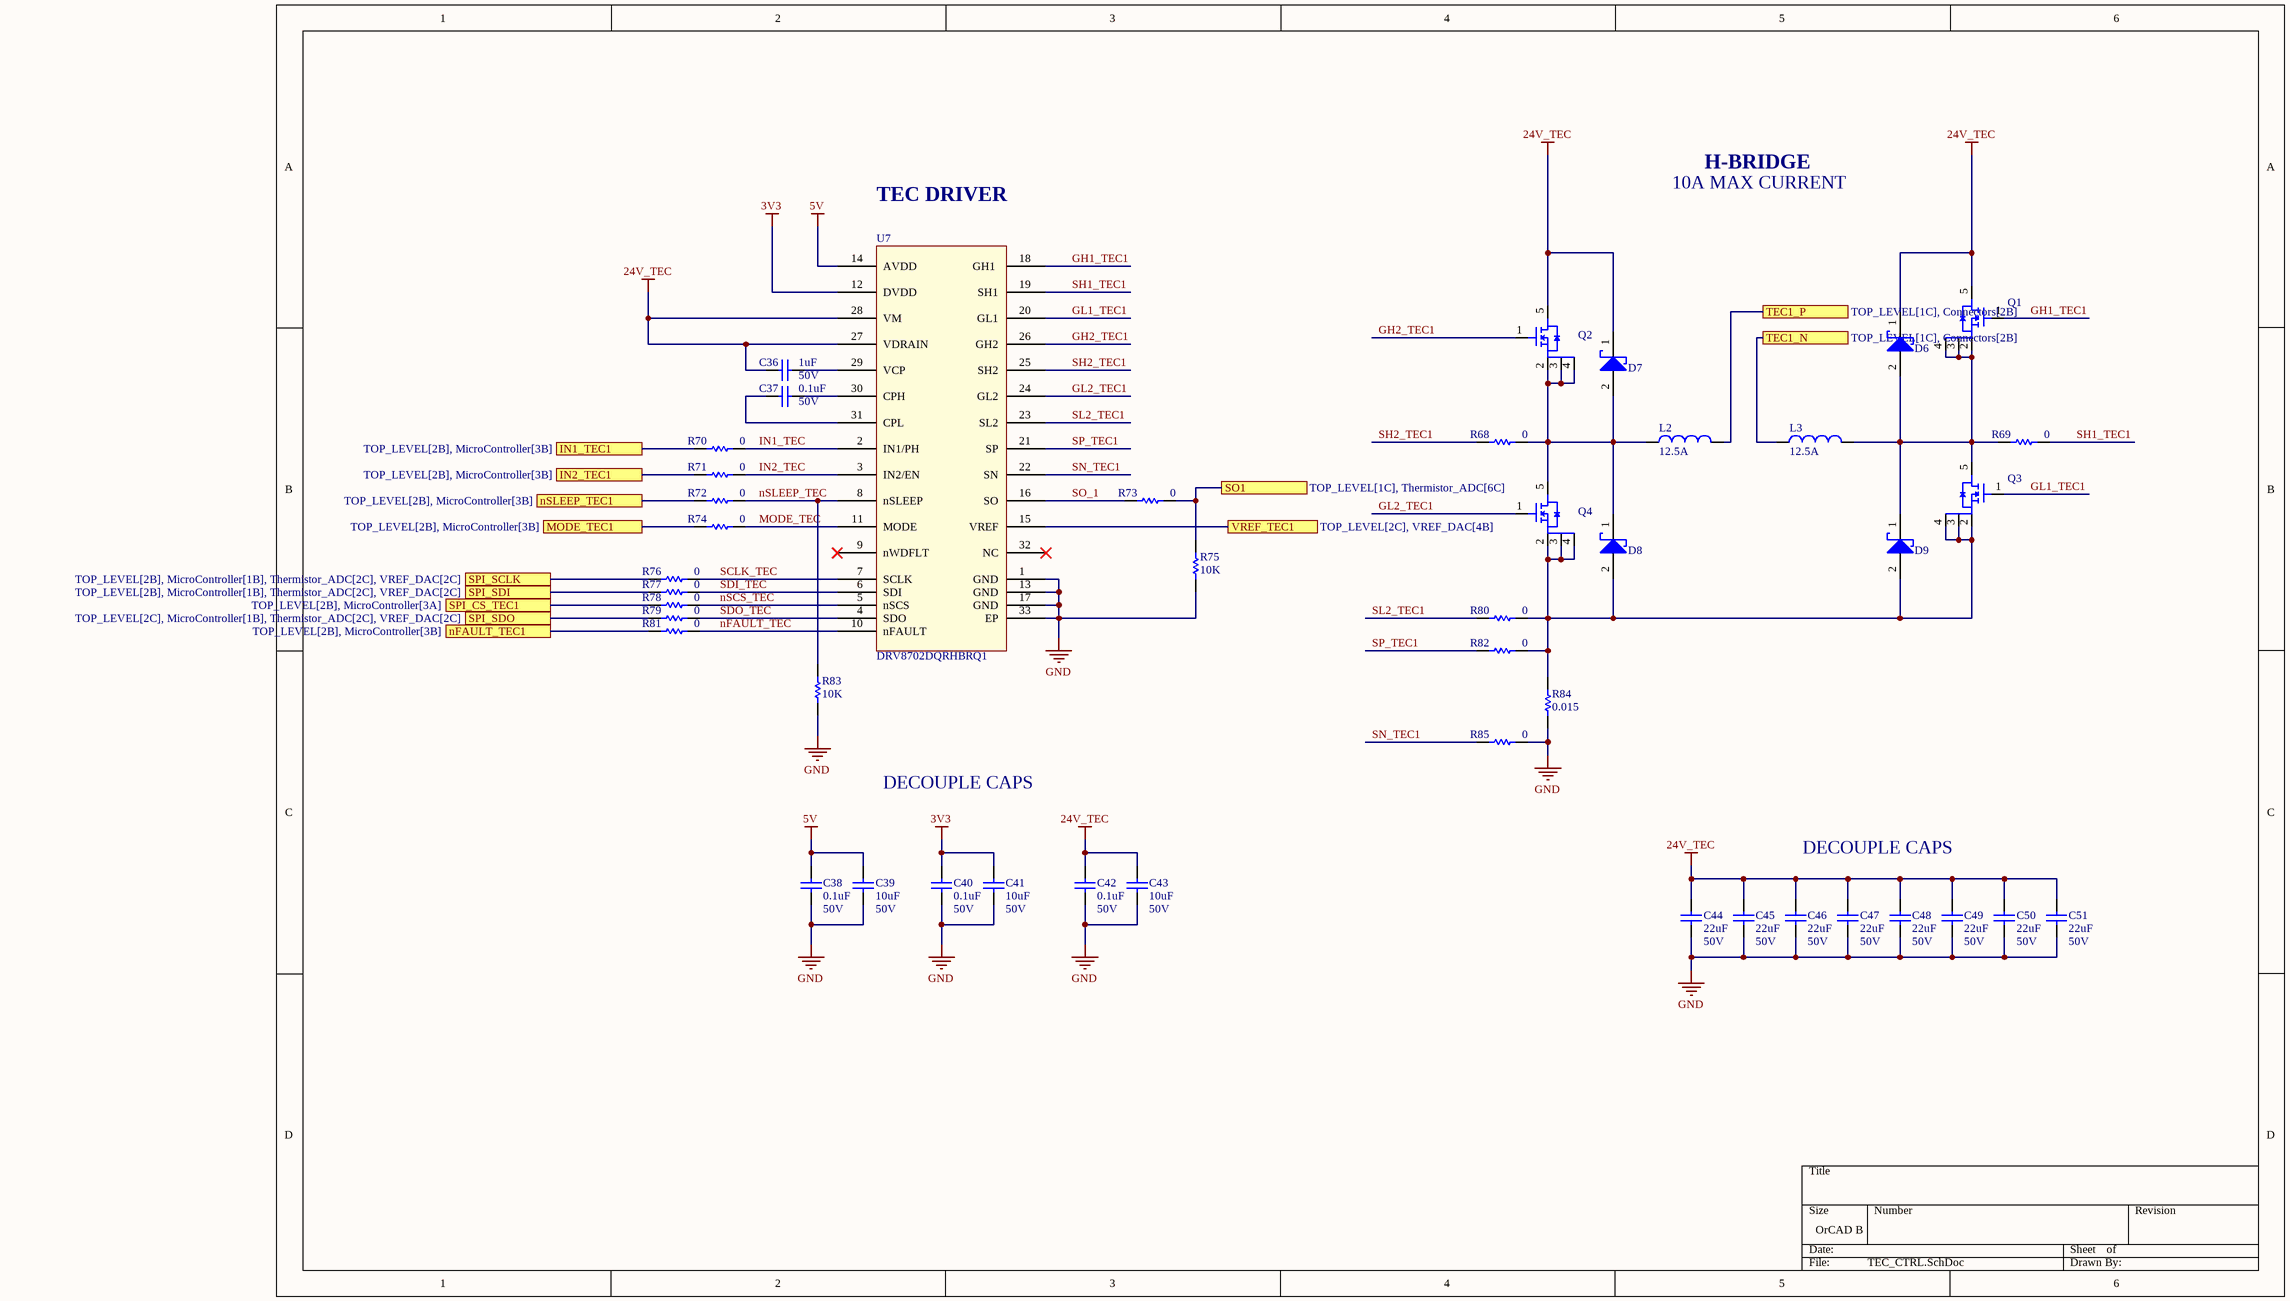
[diagram p3: TEC_CTRL.SchDoc]

### Parts
C36  value 1uF  Rating: 50V  [DEFAULT_CAPACITOR_0805]  (hidden comment: CL21B105KBFNNNE)
C37  value 0.1uF  Rating: 50V  [DEFAULT_CAPACITOR_0805]  (hidden comment: KGM21NR71H104KT)
C38  value 0.1uF  Rating: 50V  [DEFAULT_CAPACITOR_0805]  (hidden comment: KGM21NR71H104KT)
C39  value 10uF  Rating: 50V  [DEFAULT_CAPACITOR_0805]  (hidden comment: GRM21BR61H106KE43L)
C40  value 0.1uF  Rating: 50V  [DEFAULT_CAPACITOR_0805]  (hidden comment: KGM21NR71H104KT)
C41  value 10uF  Rating: 50V  [DEFAULT_CAPACITOR_0805]  (hidden comment: GRM21BR61H106KE43L)
C42  value 0.1uF  Rating: 50V  [DEFAULT_CAPACITOR_0805]  (hidden comment: KGM21NR71H104KT)
C43  value 10uF  Rating: 50V  [DEFAULT_CAPACITOR_0805]  (hidden comment: GRM21BR61H106KE43L)
C44  value 22uF  Rating: 50V  [DEFAULT_CAPACITOR_2220]  (hidden comment: C5750X7R1H226M250KB)
C45  value 22uF  Rating: 50V  [DEFAULT_CAPACITOR_2220]  (hidden comment: C5750X7R1H226M250KB)
C46  value 22uF  Rating: 50V  [DEFAULT_CAPACITOR_2220]  (hidden comment: C5750X7R1H226M250KB)
C47  value 22uF  Rating: 50V  [DEFAULT_CAPACITOR_2220]  (hidden comment: C5750X7R1H226M250KB)
C48  value 22uF  Rating: 50V  [DEFAULT_CAPACITOR_2220]  (hidden comment: C5750X7R1H226M250KB)
C49  value 22uF  Rating: 50V  [DEFAULT_CAPACITOR_2220]  (hidden comment: C5750X7R1H226M250KB)
C50  value 22uF  Rating: 50V  [DEFAULT_CAPACITOR_2220]  (hidden comment: C5750X7R1H226M250KB)
C51  value 22uF  Rating: 50V  [DEFAULT_CAPACITOR_2220]  (hidden comment: C5750X7R1H226M250KB)
D6  B2100Q-13-F  [B2100Q-13-F-SMB]  (value not drawn)
D7  B2100Q-13-F  [B2100Q-13-F-SMB]  (value not drawn)
D8  B2100Q-13-F  [B2100Q-13-F-SMB]  (value not drawn)
D9  B2100Q-13-F  [B2100Q-13-F-SMB]  (value not drawn)
L2  Rating: 12.5A  [BOURNS-SRP1770TA]  (hidden comment: SRP1770TA-150M)
L3  Rating: 12.5A  [BOURNS-SRP1770TA]  (hidden comment: SRP1770TA-150M)
Q1  BUK7S2R0-40HJ  [BUK7S2R0-40HJ-SOT1235]  (value not drawn)
Q2  BUK7S2R0-40HJ  [BUK7S2R0-40HJ-SOT1235]  (value not drawn)
Q3  BUK7S2R0-40HJ  [BUK7S2R0-40HJ-SOT1235]  (value not drawn)
Q4  BUK7S2R0-40HJ  [BUK7S2R0-40HJ-SOT1235]  (value not drawn)
R68  value 0  [DEFAULT_RESISTOR_0805]  (hidden comment: RC0805JR-070RL)
R69  value 0  [DEFAULT_RESISTOR_0805]  (hidden comment: RC0805JR-070RL)
R70  value 0  [DEFAULT_RESISTOR_0805]  (hidden comment: RC0805JR-070RL)
R71  value 0  [DEFAULT_RESISTOR_0805]  (hidden comment: RC0805JR-070RL)
R72  value 0  [DEFAULT_RESISTOR_0805]  (hidden comment: RC0805JR-070RL)
R73  value 0  [DEFAULT_RESISTOR_0805]  (hidden comment: RC0805JR-070RL)
R74  value 0  [DEFAULT_RESISTOR_0805]  (hidden comment: RC0805JR-070RL)
R75  value 10K  [DEFAULT_RESISTOR_0805]  (hidden comment: CRCW080510K0FKEA)
R76  value 0  [DEFAULT_RESISTOR_0805]  (hidden comment: RC0805JR-070RL)
R77  value 0  [DEFAULT_RESISTOR_0805]  (hidden comment: RC0805JR-070RL)
R78  value 0  [DEFAULT_RESISTOR_0805]  (hidden comment: RC0805JR-070RL)
R79  value 0  [DEFAULT_RESISTOR_0805]  (hidden comment: RC0805JR-070RL)
R80  value 0  [DEFAULT_RESISTOR_0805]  (hidden comment: RC0805JR-070RL)
R81  value 0  [DEFAULT_RESISTOR_0805]  (hidden comment: RC0805JR-070RL)
R82  value 0  [DEFAULT_RESISTOR_0805]  (hidden comment: RC0805JR-070RL)
R83  value 10K  [DEFAULT_RESISTOR_0805]  (hidden comment: CRCW080510K0FKEA)
R84  value 0.015  [DEFAULT_RESISTOR_2512]  (hidden comment: CRA2512-FZ-R015ELF)
R85  value 0  [DEFAULT_RESISTOR_0805]  (hidden comment: RC0805JR-070RL)
U7  DRV8702DQRHBRQ1  [DRV8702DQRHBRQ1-32VQFN]

### Ports
IN1_TEC1 (see TOP_LEVEL[2B], MicroController[3B]), IN2_TEC1 (see TOP_LEVEL[2B], MicroController[3B]), MODE_TEC1 (see TOP_LEVEL[2B], MicroController[3B]), nFAULT_TEC1 (see TOP_LEVEL[2B], MicroController[3B]), nSLEEP_TEC1 (see TOP_LEVEL[2B], MicroController[3B]), SO1 (see TOP_LEVEL[1C], Thermistor_ADC[6C]), SPI_CS_TEC1 (see TOP_LEVEL[2B], MicroController[3A]), SPI_SCLK (see TOP_LEVEL[2B], MicroController[1B], Thermistor_ADC[2C], VREF_DAC[2C]), SPI_SDI (see TOP_LEVEL[2B], MicroController[1B], Thermistor_ADC[2C], VREF_DAC[2C]), SPI_SDO (see TOP_LEVEL[2C], MicroController[1B], Thermistor_ADC[2C], VREF_DAC[2C]), TEC1_N (see TOP_LEVEL[1C], Connectors[2B]), TEC1_P (see TOP_LEVEL[1C], Connectors[2B]), VREF_TEC1 (see TOP_LEVEL[2C], VREF_DAC[4B])

### Nets
3V3: C40.2 C41.2 U7.12(DVDD)
5V: C38.2 C39.2 U7.14(AVDD)
24V_TEC: C36.2 C42.2 C43.2 C44.2 C45.2 C46.2 C47.2 C48.2 C49.2 C50.2 C51.2 D6.1(K) D7.1(K) Q1.5(D) Q2.5(D) U7.27(VDRAIN) U7.28(VM)
GND: C38.1 C39.1 C40.1 C41.1 C42.1 C43.1 C44.1 C45.1 C46.1 C47.1 C48.1 C49.1 C50.1 C51.1 R75.2 R83.2 R84.2 R85.1 U7.1(GND) U7.13(GND) U7.17(GND) U7.33(EP)
GH1_TEC1: Q1.1(G) U7.18(GH1)
GH2_TEC1: Q2.1(G) U7.26(GH2)
GL1_TEC1: Q3.1(G) U7.20(GL1)
GL2_TEC1: Q4.1(G) U7.24(GL2)
IN1_TEC: R70.1 U7.2(IN1/PH)
IN1_TEC1: R70.2 ; port IN1_TEC1
IN2_TEC: R71.1 U7.3(IN2/EN)
IN2_TEC1: R71.2 ; port IN2_TEC1
MODE_TEC: R74.1 U7.11(MODE)
MODE_TEC1: R74.2 ; port MODE_TEC1
nFAULT_TEC: R81.1 U7.10(nFAULT)
nFAULT_TEC1: R81.2 ; port nFAULT_TEC1
nSCS_TEC: R78.1 U7.5(nSCS)
nSLEEP_TEC: R72.1 R83.1 U7.8(nSLEEP)
nSLEEP_TEC1: R72.2 ; port nSLEEP_TEC1
SCLK_TEC: R76.1 U7.7(SCLK)
SDI_TEC: R77.1 U7.6(SDI)
SDO_TEC: R79.1 U7.4(SDO)
SH1_TEC1: R69.1 U7.19(SH1)
SH2_TEC1: R68.2 U7.25(SH2)
SL2_TEC1: R80.2 U7.23(SL2)
SN_TEC1: R85.2 U7.22(SN)
SO1: R73.1 R75.1 ; port SO1
SO_1: R73.2 U7.16(SO)
SP_TEC1: R82.2 U7.21(SP)
SPI_CS_TEC1: R78.2 ; port SPI_CS_TEC1
SPI_SCLK: R76.2 ; port SPI_SCLK
SPI_SDI: R77.2 ; port SPI_SDI
SPI_SDO: R79.2 ; port SPI_SDO
TEC1_N: L3.1 ; port TEC1_N
TEC1_P: L2.2 ; port TEC1_P
VREF_TEC1: U7.15(VREF) ; port VREF_TEC1
NetC36_1: C36.1 U7.29(VCP)
NetC37_1: C37.1 U7.30(CPH)
NetC37_2: C37.2 U7.31(CPL)
NetD6_2: D6.2(A) D9.1(K) L3.2 Q1.2(D) Q1.3(S) Q1.4(D) Q3.5(D) R69.2
NetD7_2: D7.2(A) D8.1(K) L2.1 Q2.2(D) Q2.3(S) Q2.4(D) Q4.5(D) R68.1
NetD8_2: D8.2(A) D9.2(A) Q3.2(D) Q3.3(S) Q3.4(D) Q4.2(D) Q4.3(S) Q4.4(D) R80.1 R82.1 R84.1

Not connected (* = marked no-connect by the designer): U7 9(nWDFLT)* 32(NC)*

### Notes on the sheet
- TEC DRIVER
- 10A MAX CURRENT
- H-BRIDGE
- DECOUPLE CAPS

### Library data of the parts
C36 = CL21B105KBFNNNE: CAP CER 1UF 50V X7R 0805; MFR PN: CL21B105KBFNNNE
C37 C38 C40 C42 = KGM21NR71H104KT: as C2 on sheet Motor and Encoder; MFR PN: KGM21NR71H104KT
C39 C41 C43 = GRM21BR61H106KE43L: CAP CER 10UF 50V X5R 0805; MFR PN: GRM21BR61H106KE43L
C44-C51 = C5750X7R1H226M250KB: CAP CER 22UF 50V X7R 2220; MFR PN: C5750X7R1H226M250KB
D6-D9 = B2100Q-13-F: DIODE SCHOTTKY 100V 2A SMB; Manufacturer: Diodes Incorporated; Manufacturer P/N: B2100Q-13-F; MFR PN: B2100Q-13-F
L2 L3 = SRP1770TA-150M: FIXED IND 15UH 12.5A 20.5MOHM SM; Manufacturer: Bourns Inc.; Value: 15uH; Manufacturer P/N: SRP1770TA-150M; MFR PN: SRP1770TA-150M
Q1-Q4 = BUK7S2R0-40HJ: N-Channel 40 V 190A (Tc) 183W (Tc) Surface Mount LFPAK88 (SOT1235); Manufacturer: Nexperia USA Inc.; MFR PN: BUK7S2R0-40HJ
R68-R74 R76-R82 R85 = RC0805JR-070RL: RES 0 OHM JUMPER 1/8W 0805; Power: 1/8W; MFR PN: RC0805JR-070RL; Tolerance: *
R75 R83 = CRCW080510K0FKEA: RES SMD 10K OHM 1% 1/4W 0805; Power: 1/4W; MFR PN: CRCW080510K0FKEA; Tolerance: 1%
R84 = CRA2512-FZ-R015ELF: RES 0.015 OHM 1% 3W 2512; Power: 3W; MFR PN: CRA2512-FZ-R015ELF; Tolerance: 1%
U7 = DRV8702DQRHBRQ1: IC MOTOR DRIVER 5.5V-45V 32VQFN; Manufacturer: Texas Instruments; MFR PN: DRV8702DQRHBRQ1; Manufacturer P/N: DRV8702DQRHBRQ1

## Sheet Fluid_Valve_CTRL.SchDoc
size OrCAD B; SheetNumber: 6; SheetTotal: 11
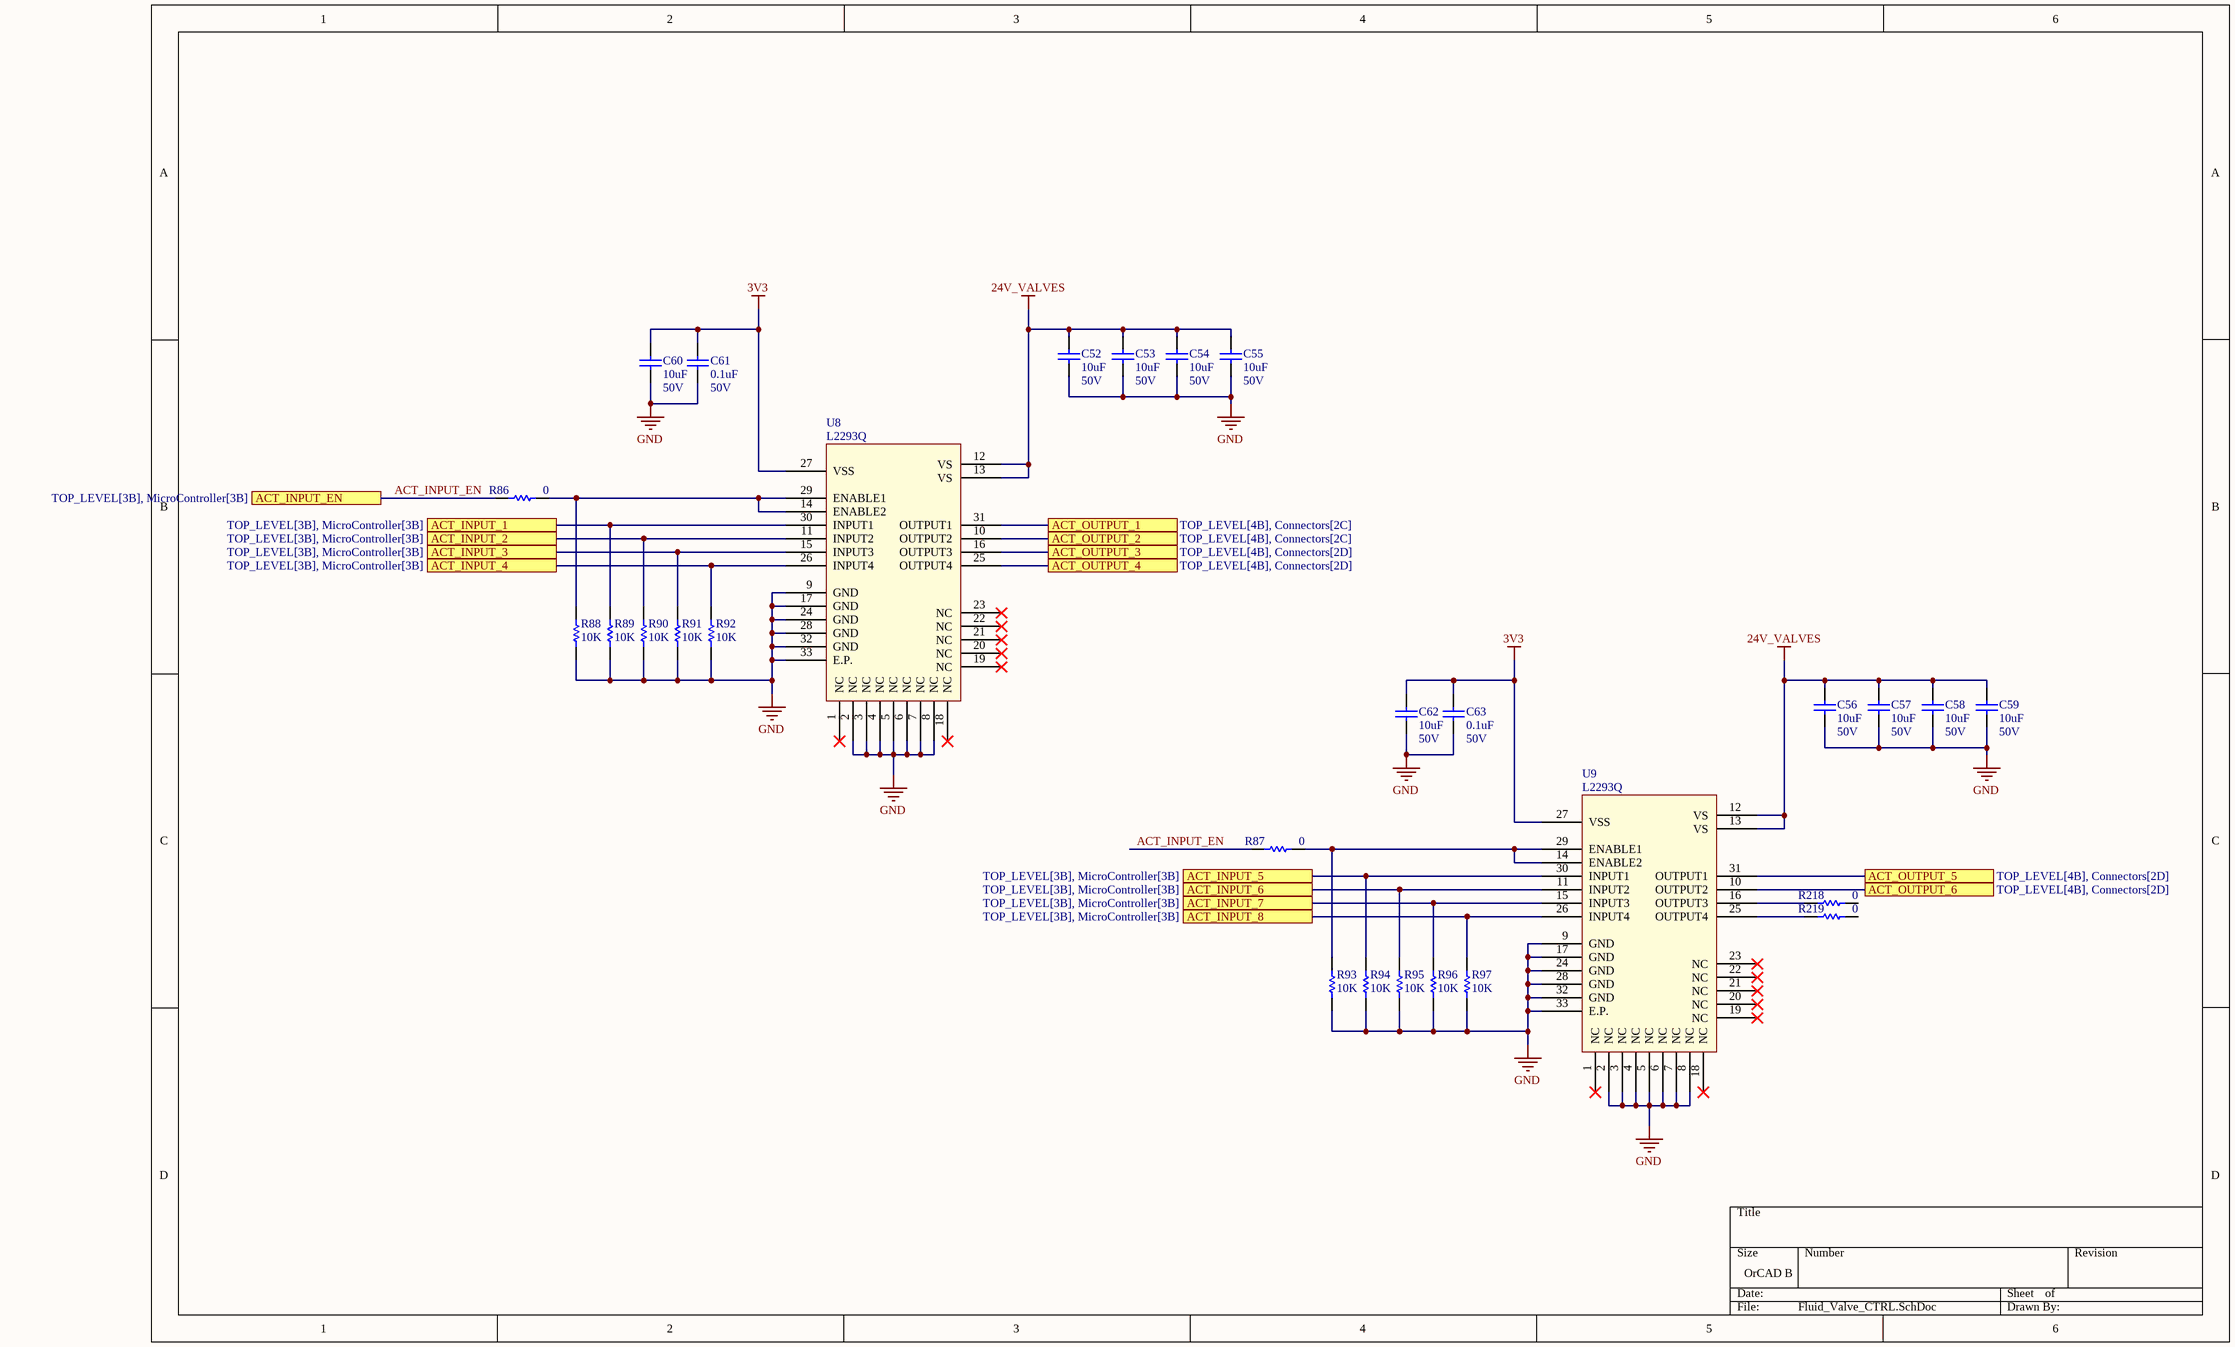
[diagram p4: Fluid_Valve_CTRL.SchDoc]

### Parts
C52  value 10uF  Rating: 50V  [DEFAULT_CAPACITOR_0805]  (hidden comment: GRM21BR61H106KE43L)
C53  value 10uF  Rating: 50V  [DEFAULT_CAPACITOR_0805]  (hidden comment: GRM21BR61H106KE43L)
C54  value 10uF  Rating: 50V  [DEFAULT_CAPACITOR_0805]  (hidden comment: GRM21BR61H106KE43L)
C55  value 10uF  Rating: 50V  [DEFAULT_CAPACITOR_0805]  (hidden comment: GRM21BR61H106KE43L)
C56  value 10uF  Rating: 50V  [DEFAULT_CAPACITOR_0805]  (hidden comment: GRM21BR61H106KE43L)
C57  value 10uF  Rating: 50V  [DEFAULT_CAPACITOR_0805]  (hidden comment: GRM21BR61H106KE43L)
C58  value 10uF  Rating: 50V  [DEFAULT_CAPACITOR_0805]  (hidden comment: GRM21BR61H106KE43L)
C59  value 10uF  Rating: 50V  [DEFAULT_CAPACITOR_0805]  (hidden comment: GRM21BR61H106KE43L)
C60  value 10uF  Rating: 50V  [DEFAULT_CAPACITOR_0805]  (hidden comment: GRM21BR61H106KE43L)
C61  value 0.1uF  Rating: 50V  [DEFAULT_CAPACITOR_0805]  (hidden comment: KGM21NR71H104KT)
C62  value 10uF  Rating: 50V  [DEFAULT_CAPACITOR_0805]  (hidden comment: GRM21BR61H106KE43L)
C63  value 0.1uF  Rating: 50V  [DEFAULT_CAPACITOR_0805]  (hidden comment: KGM21NR71H104KT)
R86  value 0  [DEFAULT_RESISTOR_0805]  (hidden comment: RC0805JR-070RL)
R87  value 0  [DEFAULT_RESISTOR_0805]  (hidden comment: RC0805JR-070RL)
R88  value 10K  [DEFAULT_RESISTOR_0805]  (hidden comment: CRCW080510K0FKEA)
R89  value 10K  [DEFAULT_RESISTOR_0805]  (hidden comment: CRCW080510K0FKEA)
R90  value 10K  [DEFAULT_RESISTOR_0805]  (hidden comment: CRCW080510K0FKEA)
R91  value 10K  [DEFAULT_RESISTOR_0805]  (hidden comment: CRCW080510K0FKEA)
R92  value 10K  [DEFAULT_RESISTOR_0805]  (hidden comment: CRCW080510K0FKEA)
R93  value 10K  [DEFAULT_RESISTOR_0805]  (hidden comment: CRCW080510K0FKEA)
R94  value 10K  [DEFAULT_RESISTOR_0805]  (hidden comment: CRCW080510K0FKEA)
R95  value 10K  [DEFAULT_RESISTOR_0805]  (hidden comment: CRCW080510K0FKEA)
R96  value 10K  [DEFAULT_RESISTOR_0805]  (hidden comment: CRCW080510K0FKEA)
R97  value 10K  [DEFAULT_RESISTOR_0805]  (hidden comment: CRCW080510K0FKEA)
R218  value 0  [DEFAULT_RESISTOR_0805]  (hidden comment: RC0805JR-070RL)
R219  value 0  [DEFAULT_RESISTOR_0805]  (hidden comment: RC0805JR-070RL)
U8  L2293Q  [L2293Q]
U9  L2293Q  [L2293Q]

### Ports
ACT_INPUT_1 (see TOP_LEVEL[3B], MicroController[3B]), ACT_INPUT_2 (see TOP_LEVEL[3B], MicroController[3B]), ACT_INPUT_3 (see TOP_LEVEL[3B], MicroController[3B]), ACT_INPUT_4 (see TOP_LEVEL[3B], MicroController[3B]), ACT_INPUT_5 (see TOP_LEVEL[3B], MicroController[3B]), ACT_INPUT_6 (see TOP_LEVEL[3B], MicroController[3B]), ACT_INPUT_7 (see TOP_LEVEL[3B], MicroController[3B]), ACT_INPUT_8 (see TOP_LEVEL[3B], MicroController[3B]), ACT_INPUT_EN (see TOP_LEVEL[3B], MicroController[3B]), ACT_OUTPUT_1 (see TOP_LEVEL[4B], Connectors[2C]), ACT_OUTPUT_2 (see TOP_LEVEL[4B], Connectors[2C]), ACT_OUTPUT_3 (see TOP_LEVEL[4B], Connectors[2D]), ACT_OUTPUT_4 (see TOP_LEVEL[4B], Connectors[2D]), ACT_OUTPUT_5 (see TOP_LEVEL[4B], Connectors[2D]), ACT_OUTPUT_6 (see TOP_LEVEL[4B], Connectors[2D])

### Nets
3V3: C60.2 C61.2 C62.2 C63.2 U8.27(VSS) U9.27(VSS)
24V_VALVES: C52.2 C53.2 C54.2 C55.2 C56.2 C57.2 C58.2 C59.2 U8.12(VS) U8.13(VS) U9.12(VS) U9.13(VS)
GND: C52.1 C53.1 C54.1 C55.1 C56.1 C57.1 C58.1 C59.1 C60.1 C61.1 C62.1 C63.1 R88.2 R89.2 R90.2 R91.2 R92.2 R93.2 R94.2 R95.2 R96.2 R97.2 U8.2(NC) U8.3(NC) U8.4(NC) U8.5(NC) U8.6(NC) U8.7(NC) U8.8(NC) U8.9(GND) U8.17(GND) U8.24(GND) U8.28(GND) U8.32(GND) U8.33(E.P.) U9.2(NC) U9.3(NC) U9.4(NC) U9.5(NC) U9.6(NC) U9.7(NC) U9.8(NC) U9.9(GND) U9.17(GND) U9.24(GND) U9.28(GND) U9.32(GND) U9.33(E.P.)
ACT_INPUT_1: R89.1 U8.30(INPUT1) ; port ACT_INPUT_1
ACT_INPUT_2: R90.1 U8.11(INPUT2) ; port ACT_INPUT_2
ACT_INPUT_3: R91.1 U8.15(INPUT3) ; port ACT_INPUT_3
ACT_INPUT_4: R92.1 U8.26(INPUT4) ; port ACT_INPUT_4
ACT_INPUT_5: R94.1 U9.30(INPUT1) ; port ACT_INPUT_5
ACT_INPUT_6: R95.1 U9.11(INPUT2) ; port ACT_INPUT_6
ACT_INPUT_7: R96.1 U9.15(INPUT3) ; port ACT_INPUT_7
ACT_INPUT_8: R97.1 U9.26(INPUT4) ; port ACT_INPUT_8
ACT_INPUT_EN: R86.2 R87.2 ; port ACT_INPUT_EN
ACT_OUTPUT_1: U8.31(OUTPUT1) ; port ACT_OUTPUT_1
ACT_OUTPUT_2: U8.10(OUTPUT2) ; port ACT_OUTPUT_2
ACT_OUTPUT_3: U8.16(OUTPUT3) ; port ACT_OUTPUT_3
ACT_OUTPUT_4: U8.25(OUTPUT4) ; port ACT_OUTPUT_4
ACT_OUTPUT_5: U9.31(OUTPUT1) ; port ACT_OUTPUT_5
ACT_OUTPUT_6: U9.10(OUTPUT2) ; port ACT_OUTPUT_6
NetR86_1: R86.1 R88.1 U8.14(ENABLE2) U8.29(ENABLE1)
NetR87_1: R87.1 R93.1 U9.14(ENABLE2) U9.29(ENABLE1)
NetR218_2: R218.2 U9.16(OUTPUT3)
NetR219_2: R219.2 U9.25(OUTPUT4)

Not connected (* = marked no-connect by the designer): R218 1; R219 1; U8 1(NC)* 18(NC)* 19(NC)* 20(NC)* 21(NC)* 22(NC)* 23(NC)*; U9 1(NC)* 18(NC)* 19(NC)* 20(NC)* 21(NC)* 22(NC)* 23(NC)*

### Library data of the parts
C52-C60 C62 = GRM21BR61H106KE43L: CAP CER 10UF 50V X5R 0805; MFR PN: GRM21BR61H106KE43L
C61 C63 = KGM21NR71H104KT: as C2 on sheet Motor and Encoder; MFR PN: KGM21NR71H104KT
R86 R87 R218 R219 = RC0805JR-070RL: RES 0 OHM JUMPER 1/8W 0805; Power: 1/8W; MFR PN: RC0805JR-070RL; Tolerance: *
R88-R97 = CRCW080510K0FKEA: RES SMD 10K OHM 1% 1/4W 0805; Power: 1/4W; MFR PN: CRCW080510K0FKEA; Tolerance: 1%
U8 U9 = L2293Q: IC HALF BRIDG DRV 600MA 32VFQFPN; Manufacturer: STMicroelectronics; MFR PN: L2293Q; Manufacturer P/N: L2293Q